# EAGLE schematic board (EAGLE 7.7.0)
8088 board with RAM expansion

## Sheet 1 of 10: CBM mainboard connectors
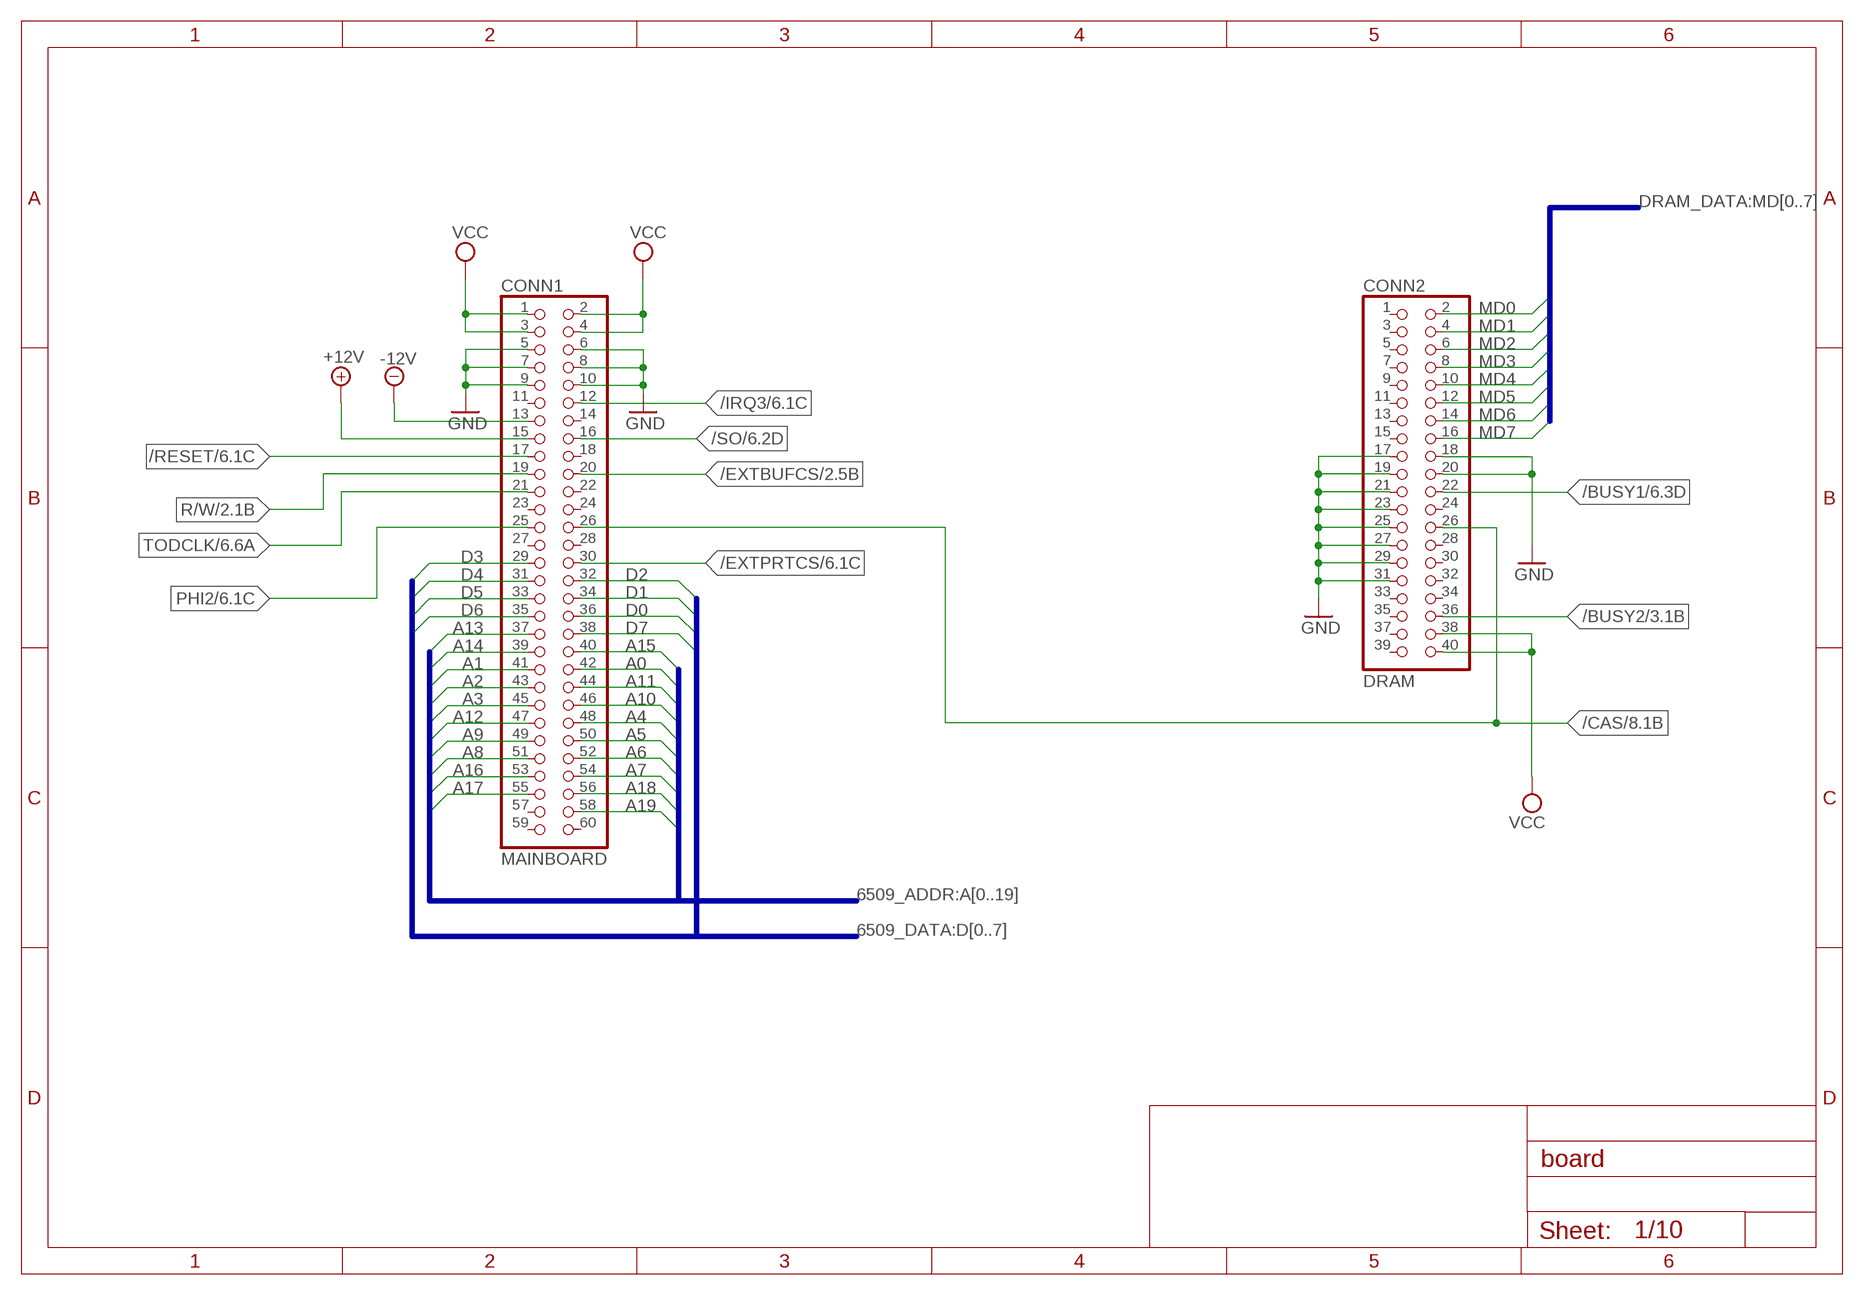
[diagram p0: schematic, sheet 1]

### Parts
CONN1  MAINBOARD  PINHD-2X30  [2X30]
CONN2  DRAM  PINHD-2X20  [2X20]

### Nets
+12V [power]: CONN1.15 ; also sheet 9
-12V [power]: CONN1.13 ; also sheet 9
/BUSY1: CONN2.22 ; also sheet 6,8
/BUSY2: CONN2.36 ; also sheet 3,8,10
/CAS: CONN1.26 CONN2.26 ; also sheet 8
/EXTBUFCS: CONN1.20 ; also sheet 2
/EXTPRTCS: CONN1.30 ; also sheet 6
/IRQ3: CONN1.12 ; also sheet 6
/RESET: CONN1.17 ; also sheet 6,8
/SO: CONN1.16 ; also sheet 6
A0: CONN1.42 ; also sheet 2,3,6
A1: CONN1.41 ; also sheet 2,3,6
A2: CONN1.43 ; also sheet 2,3,6
A3: CONN1.45 ; also sheet 2,3,6
A4: CONN1.48 ; also sheet 2,3
A5: CONN1.50 ; also sheet 2,3
A6: CONN1.52 ; also sheet 2,3
A7: CONN1.54 ; also sheet 2,3
A8: CONN1.51 ; also sheet 2,3
A9: CONN1.49 ; also sheet 2,3
A10: CONN1.46 ; also sheet 2,3
A11: CONN1.44 ; also sheet 2,3
A12: CONN1.47 ; also sheet 2,3,8
A13: CONN1.37 ; also sheet 3,8
A14: CONN1.39 ; also sheet 3,8
A15: CONN1.40 ; also sheet 3,8
A16: CONN1.53 ; also sheet 4,8
A17: CONN1.55 ; also sheet 4,8
A18: CONN1.56 ; also sheet 4,8
A19: CONN1.58 ; also sheet 8
D0: CONN1.36 ; also sheet 2,6
D1: CONN1.34 ; also sheet 2,6
D2: CONN1.32 ; also sheet 2,6
D3: CONN1.29 ; also sheet 2,6
D4: CONN1.31 ; also sheet 2,6
D5: CONN1.33 ; also sheet 2,6
D6: CONN1.35 ; also sheet 2,6
D7: CONN1.38 ; also sheet 2,6
GND [power]: CONN1.5 CONN1.6 CONN1.7 CONN1.8 CONN1.9 CONN1.10 CONN2.17 CONN2.18 CONN2.19 CONN2.20 CONN2.21 CONN2.23 CONN2.25 CONN2.27 CONN2.29 CONN2.31 ; also sheet 2,3,4,5,6,7,8,9,10
MD0: CONN2.2 ; also sheet 4
MD1: CONN2.4 ; also sheet 4
MD2: CONN2.6 ; also sheet 4
MD3: CONN2.8 ; also sheet 4
MD4: CONN2.10 ; also sheet 4
MD5: CONN2.12 ; also sheet 4
MD6: CONN2.14 ; also sheet 4
MD7: CONN2.16 ; also sheet 4
PHI2: CONN1.25 ; also sheet 6
R/W: CONN1.19 ; also sheet 2,6,8
TODCLK: CONN1.21 ; also sheet 6
VCC [power]: CONN1.1 CONN1.2 CONN1.3 CONN1.4 CONN2.38 CONN2.40 ; also sheet 2,3,4,5,6,7,8,9,10
Unconnected: CONN1.11 CONN1.14 CONN1.18 CONN1.22 CONN1.23 CONN1.24 CONN1.27 CONN1.28 CONN1.57 CONN1.59 CONN1.60 CONN2.1 CONN2.3 CONN2.5 CONN2.7 CONN2.9 CONN2.11 CONN2.13 CONN2.15 CONN2.24 CONN2.28 CONN2.30 CONN2.32 CONN2.33 CONN2.34 CONN2.35 CONN2.37 CONN2.39

### Buses
6509_ADDR:A[0..19]
6509_DATA:D[0..7]
DRAM_DATA:MD[0..7]

## Sheet 2 of 10: 6509 expansion EPROMs
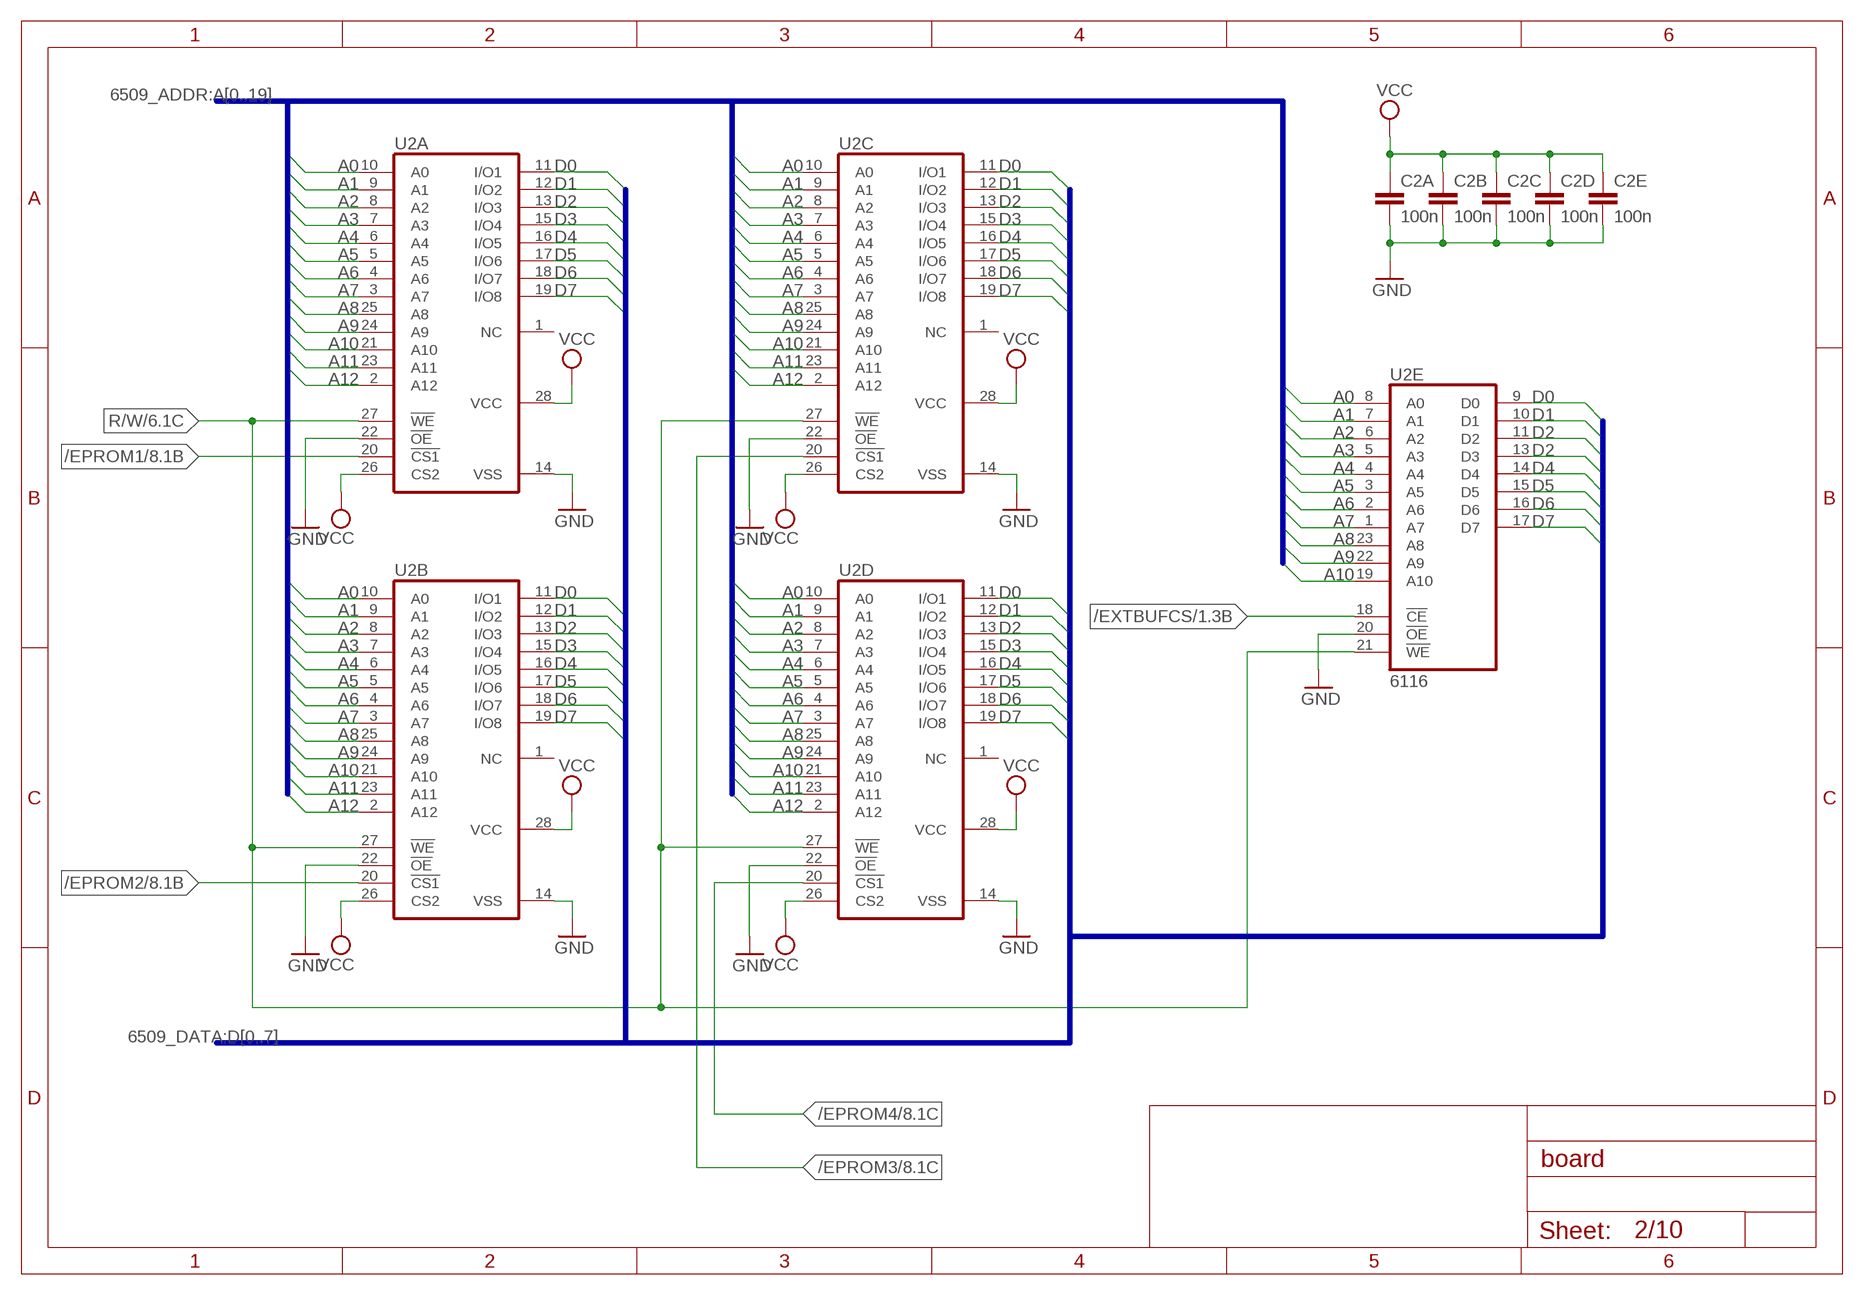
[diagram p1: schematic, sheet 2]

### Parts
C2A  100n  C-EU050-025X075  [C050-025X075]
C2B  100n  C-EU050-025X075  [C050-025X075]
C2C  100n  C-EU050-025X075  [C050-025X075]
C2D  100n  C-EU050-025X075  [C050-025X075]
C2E  100n  C-EU050-025X075  [C050-025X075]
U2A  6264A  [DIL28-6]
U2B  6264A  [DIL28-6]
U2C  6264A  [DIL28-6]
U2D  6264A  [DIL28-6]
U2E  6116  [DIL24]

### Nets
/EPROM1: U2A.20(!CS1) ; also sheet 8
/EPROM2: U2B.20(!CS1) ; also sheet 8
/EPROM3: U2C.20(!CS1) ; also sheet 8
/EPROM4: U2D.20(!CS1) ; also sheet 8
/EXTBUFCS: U2E.18(!CE) ; also sheet 1
A0: U2A.10(A0) U2B.10(A0) U2C.10(A0) U2D.10(A0) U2E.8(A0) ; also sheet 1,3,6
A1: U2A.9(A1) U2B.9(A1) U2C.9(A1) U2D.9(A1) U2E.7(A1) ; also sheet 1,3,6
A2: U2A.8(A2) U2B.8(A2) U2C.8(A2) U2D.8(A2) U2E.6(A2) ; also sheet 1,3,6
A3: U2A.7(A3) U2B.7(A3) U2C.7(A3) U2D.7(A3) U2E.5(A3) ; also sheet 1,3,6
A4: U2A.6(A4) U2B.6(A4) U2C.6(A4) U2D.6(A4) U2E.4(A4) ; also sheet 1,3
A5: U2A.5(A5) U2B.5(A5) U2C.5(A5) U2D.5(A5) U2E.3(A5) ; also sheet 1,3
A6: U2A.4(A6) U2B.4(A6) U2C.4(A6) U2D.4(A6) U2E.2(A6) ; also sheet 1,3
A7: U2A.3(A7) U2B.3(A7) U2C.3(A7) U2D.3(A7) U2E.1(A7) ; also sheet 1,3
A8: U2A.25(A8) U2B.25(A8) U2C.25(A8) U2D.25(A8) U2E.23(A8) ; also sheet 1,3
A9: U2A.24(A9) U2B.24(A9) U2C.24(A9) U2D.24(A9) U2E.22(A9) ; also sheet 1,3
A10: U2A.21(A10) U2B.21(A10) U2C.21(A10) U2D.21(A10) U2E.19(A10) ; also sheet 1,3
A11: U2A.23(A11) U2B.23(A11) U2C.23(A11) U2D.23(A11) ; also sheet 1,3
A12: U2A.2(A12) U2B.2(A12) U2C.2(A12) U2D.2(A12) ; also sheet 1,3,8
D0: U2A.11(I/O1) U2B.11(I/O1) U2C.11(I/O1) U2D.11(I/O1) U2E.9(D0) ; also sheet 1,6
D1: U2A.12(I/O2) U2B.12(I/O2) U2C.12(I/O2) U2D.12(I/O2) U2E.10(D1) ; also sheet 1,6
D2: U2A.13(I/O3) U2B.13(I/O3) U2C.13(I/O3) U2D.13(I/O3) U2E.11(D2) ; also sheet 1,6
D3: U2A.15(I/O4) U2B.15(I/O4) U2C.15(I/O4) U2D.15(I/O4) U2E.13(D3) ; also sheet 1,6
D4: U2A.16(I/O5) U2B.16(I/O5) U2C.16(I/O5) U2D.16(I/O5) U2E.14(D4) ; also sheet 1,6
D5: U2A.17(I/O6) U2B.17(I/O6) U2C.17(I/O6) U2D.17(I/O6) U2E.15(D5) ; also sheet 1,6
D6: U2A.18(I/O7) U2B.18(I/O7) U2C.18(I/O7) U2D.18(I/O7) U2E.16(D6) ; also sheet 1,6
D7: U2A.19(I/O8) U2B.19(I/O8) U2C.19(I/O8) U2D.19(I/O8) U2E.17(D7) ; also sheet 1,6
GND [power]: C2A.2 C2B.2 C2C.2 C2D.2 C2E.2 U2A.14(VSS) U2A.22(!OE) U2B.14(VSS) U2B.22(!OE) U2C.14(VSS) U2C.22(!OE) U2D.14(VSS) U2D.22(!OE) U2E.20(!OE) ; also sheet 1,3,4,5,6,7,8,9,10
R/W: U2A.27(!WE) U2B.27(!WE) U2C.27(!WE) U2D.27(!WE) U2E.21(!WE) ; also sheet 1,6,8
VCC [power]: C2A.1 C2B.1 C2C.1 C2D.1 C2E.1 U2A.26(CS2) U2A.28(VCC) U2B.26(CS2) U2B.28(VCC) U2C.26(CS2) U2C.28(VCC) U2D.26(CS2) U2D.28(VCC) ; also sheet 1,3,4,5,6,7,8,9,10
Unconnected: U2A.1(NC) U2B.1(NC) U2C.1(NC) U2D.1(NC)

### Buses
6509_ADDR:A[0..19]
6509_DATA:D[0..7]

## Sheet 3 of 10: RAM address multiplexers
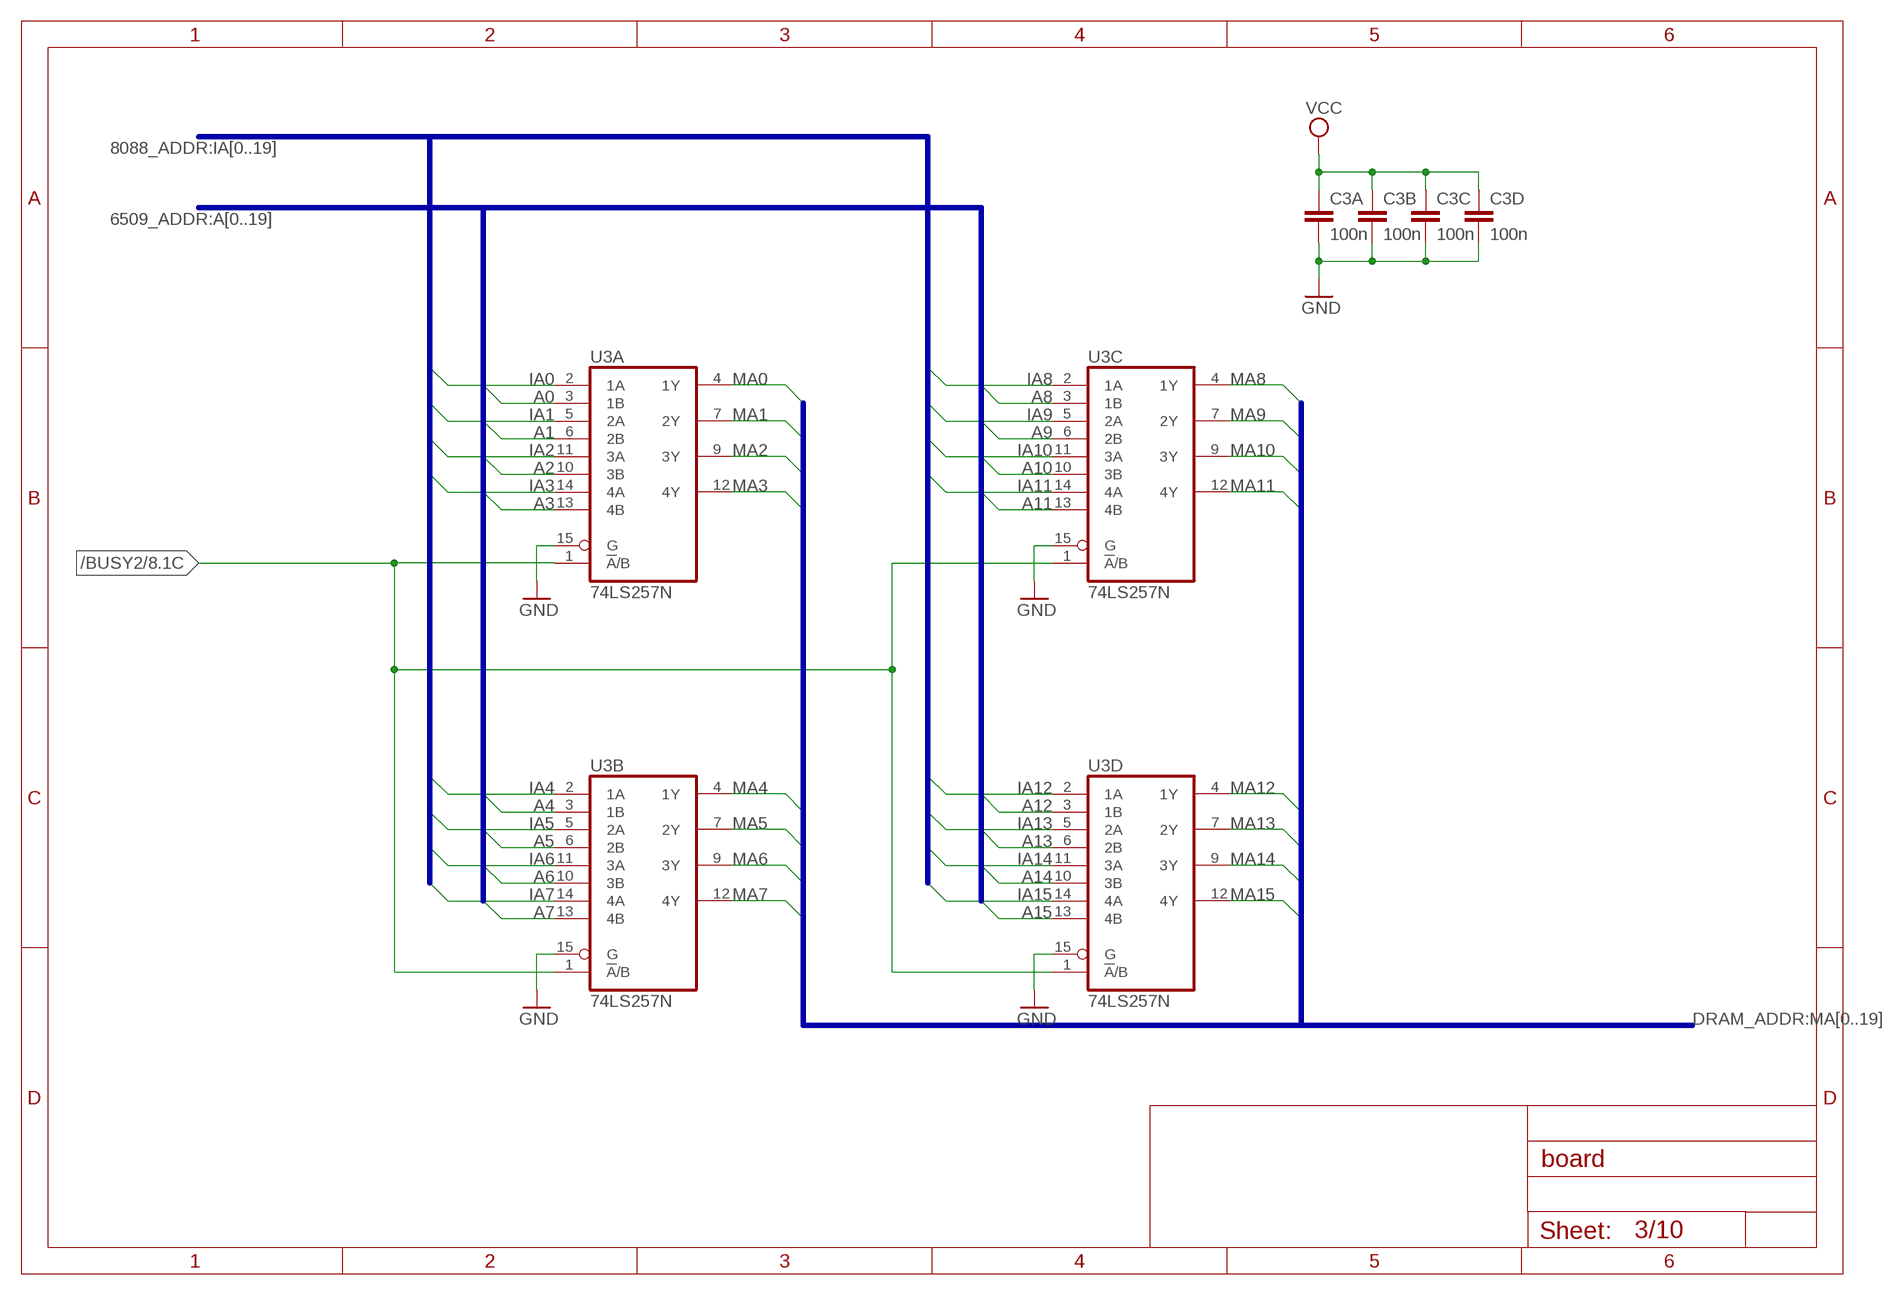
[diagram p2: schematic, sheet 3]

### Parts
C3A  100n  C-EU050-025X075  [C050-025X075]
C3B  100n  C-EU050-025X075  [C050-025X075]
C3C  100n  C-EU050-025X075  [C050-025X075]
C3D  100n  C-EU050-025X075  [C050-025X075]
U3A  74LS257N  [DIL16]
U3B  74LS257N  [DIL16]
U3C  74LS257N  [DIL16]
U3D  74LS257N  [DIL16]

### Nets
/BUSY2: U3A.1(!A!/B) U3B.1(!A!/B) U3C.1(!A!/B) U3D.1(!A!/B) ; also sheet 1,8,10
A0: U3A.3(1B) ; also sheet 1,2,6
A1: U3A.6(2B) ; also sheet 1,2,6
A2: U3A.10(3B) ; also sheet 1,2,6
A3: U3A.13(4B) ; also sheet 1,2,6
A4: U3B.3(1B) ; also sheet 1,2
A5: U3B.6(2B) ; also sheet 1,2
A6: U3B.10(3B) ; also sheet 1,2
A7: U3B.13(4B) ; also sheet 1,2
A8: U3C.3(1B) ; also sheet 1,2
A9: U3C.6(2B) ; also sheet 1,2
A10: U3C.10(3B) ; also sheet 1,2
A11: U3C.13(4B) ; also sheet 1,2
A12: U3D.3(1B) ; also sheet 1,2,8
A13: U3D.6(2B) ; also sheet 1,8
A14: U3D.10(3B) ; also sheet 1,8
A15: U3D.13(4B) ; also sheet 1,8
GND [power]: C3A.2 C3B.2 C3C.2 C3D.2 U3A.15(G) U3B.15(G) U3C.15(G) U3D.15(G) ; also sheet 1,2,4,5,6,7,8,9,10
IA0: U3A.2(1A) ; also sheet 6,7,9
IA1: U3A.5(2A) ; also sheet 6,7,9
IA2: U3A.11(3A) ; also sheet 7,9
IA3: U3A.14(4A) ; also sheet 7,9
IA4: U3B.2(1A) ; also sheet 7,9
IA5: U3B.5(2A) ; also sheet 7,9
IA6: U3B.11(3A) ; also sheet 7,9
IA7: U3B.14(4A) ; also sheet 7,9
IA8: U3C.2(1A) ; also sheet 7,8,9
IA9: U3C.5(2A) ; also sheet 7,8,9
IA10: U3C.11(3A) ; also sheet 7,8,9
IA11: U3C.14(4A) ; also sheet 7,8,9
IA12: U3D.2(1A) ; also sheet 7,9
IA13: U3D.5(2A) ; also sheet 7,9
IA14: U3D.11(3A) ; also sheet 7,9
IA15: U3D.14(4A) ; also sheet 7,9
MA0: U3A.4(1Y) ; also sheet 4
MA1: U3A.7(2Y) ; also sheet 4
MA2: U3A.9(3Y) ; also sheet 4
MA3: U3A.12(4Y) ; also sheet 4
MA4: U3B.4(1Y) ; also sheet 4
MA5: U3B.7(2Y) ; also sheet 4
MA6: U3B.9(3Y) ; also sheet 4
MA7: U3B.12(4Y) ; also sheet 4
MA8: U3C.4(1Y) ; also sheet 4
MA9: U3C.7(2Y) ; also sheet 4
MA10: U3C.9(3Y) ; also sheet 4
MA11: U3C.12(4Y) ; also sheet 4
MA12: U3D.4(1Y) ; also sheet 4
MA13: U3D.7(2Y) ; also sheet 4
MA14: U3D.9(3Y) ; also sheet 4
MA15: U3D.12(4Y) ; also sheet 4
VCC [power]: C3A.1 C3B.1 C3C.1 C3D.1 ; also sheet 1,2,4,5,6,7,8,9,10

### Buses
6509_ADDR:A[0..19]
8088_ADDR:IA[0..19]
DRAM_ADDR:MA[0..19]

## Sheet 4 of 10: Expansion RAM
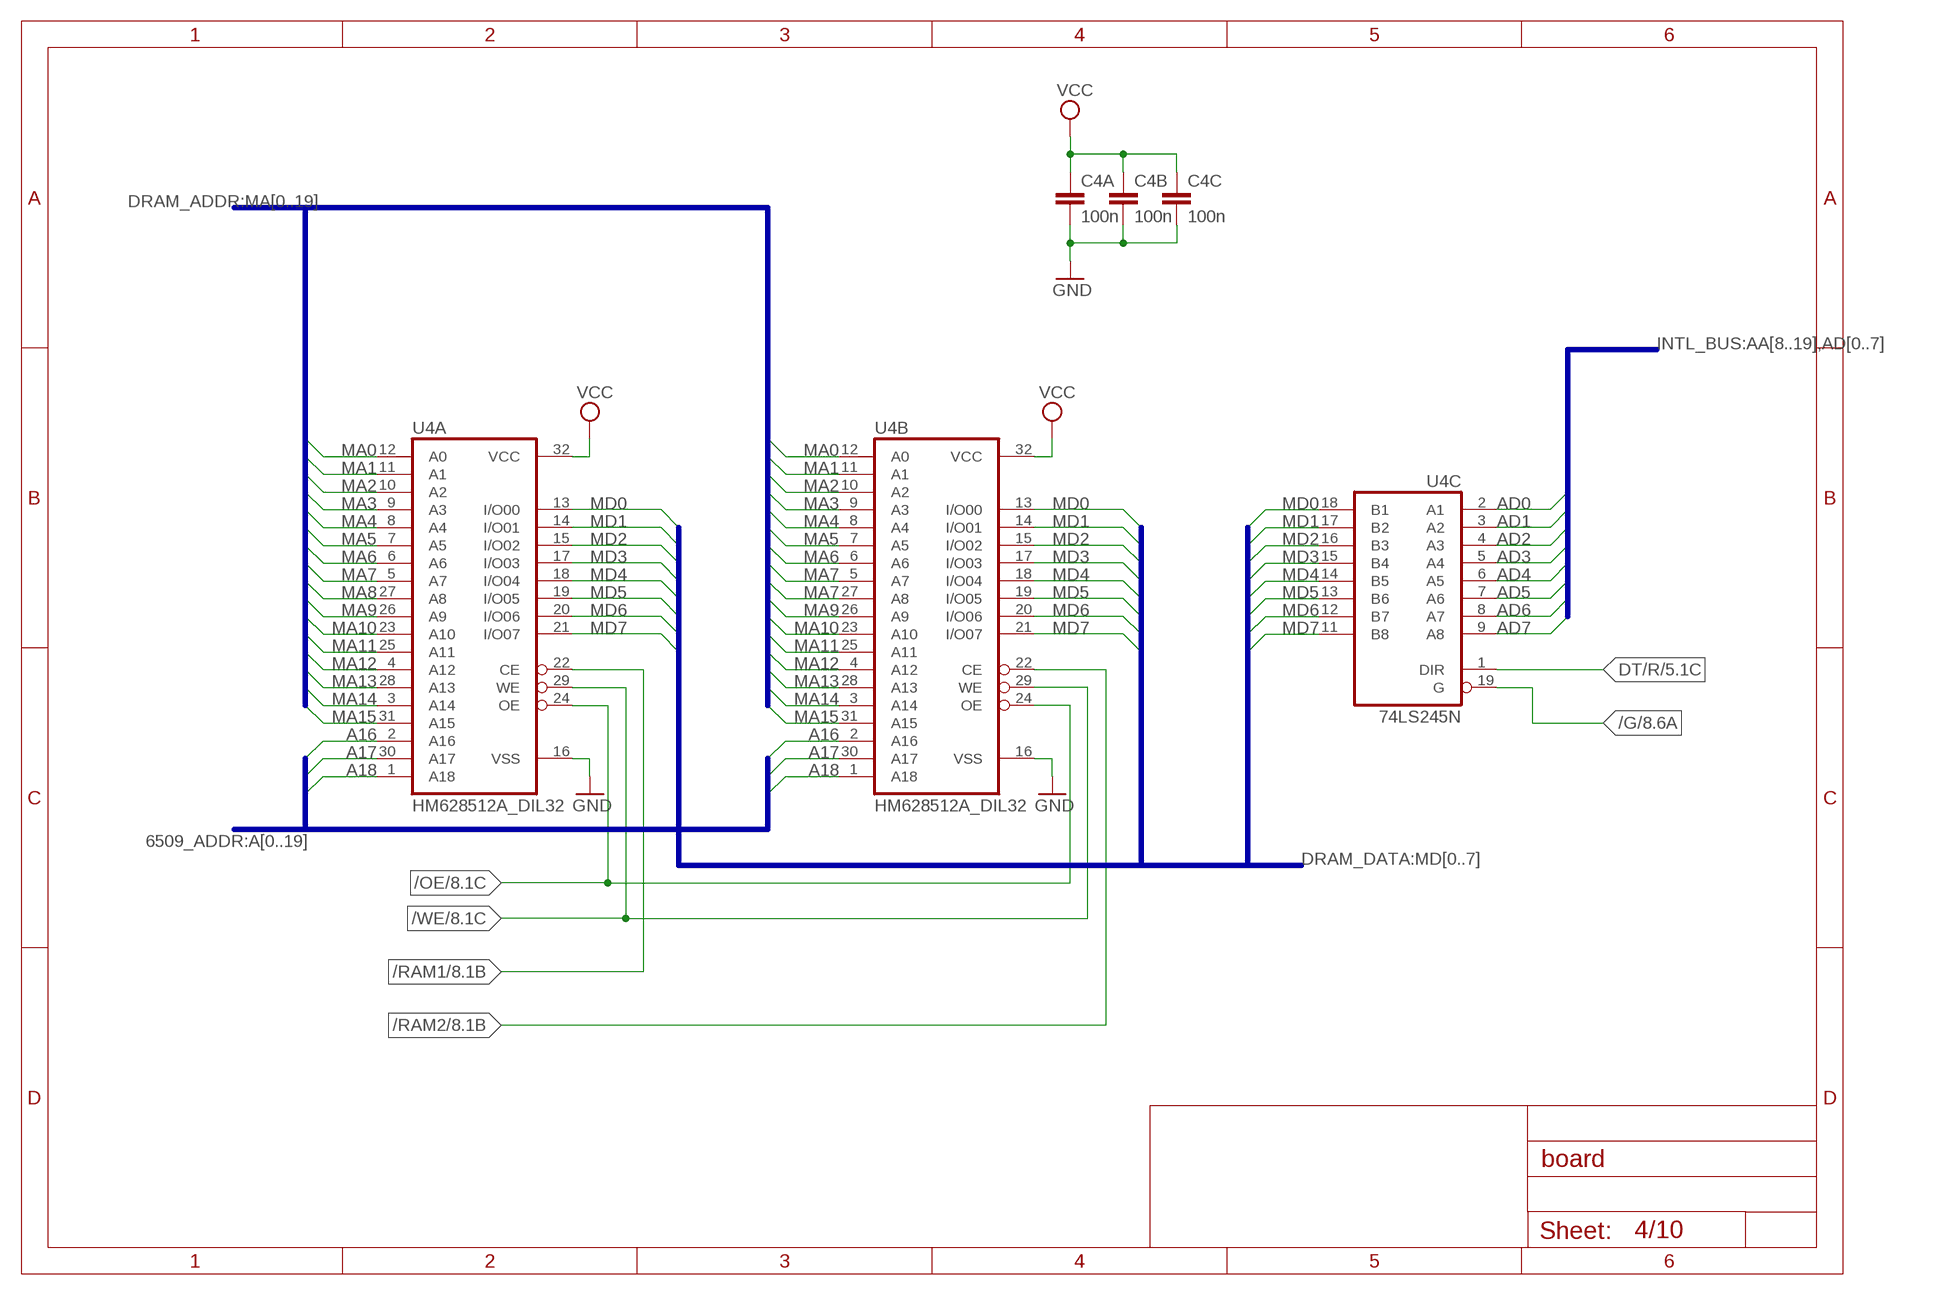
[diagram p3: schematic, sheet 4]

### Parts
C4A  100n  C-EU050-025X075  [C050-025X075]
C4B  100n  C-EU050-025X075  [C050-025X075]
C4C  100n  C-EU050-025X075  [C050-025X075]
U4A  HM628512A_DIL32  [DIL32]
U4B  HM628512A_DIL32  [DIL32]
U4C  74LS245N  [DIL20]

### Nets
/G: U4C.19(G) ; also sheet 8
/OE: U4A.24(OE) U4B.24(OE) ; also sheet 8
/RAM1: U4A.22(CE) ; also sheet 8
/RAM2: U4B.22(CE) ; also sheet 8
/WE: U4A.29(WE) U4B.29(WE) ; also sheet 8
A16: U4A.2(A16) U4B.2(A16) ; also sheet 1,8
A17: U4A.30(A17) U4B.30(A17) ; also sheet 1,8
A18: U4A.1(A18) U4B.1(A18) ; also sheet 1,8
AD0: U4C.2(A1) ; also sheet 5,6,7,8,9
AD1: U4C.3(A2) ; also sheet 5,6,7,8,9
AD2: U4C.4(A3) ; also sheet 5,6,7,8,9
AD3: U4C.5(A4) ; also sheet 5,6,7,8,9
AD4: U4C.6(A5) ; also sheet 5,6,7,8,9
AD5: U4C.7(A6) ; also sheet 5,6,7,8,9
AD6: U4C.8(A7) ; also sheet 5,6,7,8,9
AD7: U4C.9(A8) ; also sheet 5,6,7,8,9
DT/R: U4C.1(DIR) ; also sheet 5
GND [power]: C4A.2 C4B.2 C4C.2 U4A.16(VSS) U4B.16(VSS) ; also sheet 1,2,3,5,6,7,8,9,10
MA0: U4A.12(A0) U4B.12(A0) ; also sheet 3
MA1: U4A.11(A1) U4B.11(A1) ; also sheet 3
MA2: U4A.10(A2) U4B.10(A2) ; also sheet 3
MA3: U4A.9(A3) U4B.9(A3) ; also sheet 3
MA4: U4A.8(A4) U4B.8(A4) ; also sheet 3
MA5: U4A.7(A5) U4B.7(A5) ; also sheet 3
MA6: U4A.6(A6) U4B.6(A6) ; also sheet 3
MA7: U4A.5(A7) U4B.5(A7) ; also sheet 3
MA8: U4A.27(A8) U4B.27(A8) ; also sheet 3
MA9: U4A.26(A9) U4B.26(A9) ; also sheet 3
MA10: U4A.23(A10) U4B.23(A10) ; also sheet 3
MA11: U4A.25(A11) U4B.25(A11) ; also sheet 3
MA12: U4A.4(A12) U4B.4(A12) ; also sheet 3
MA13: U4A.28(A13) U4B.28(A13) ; also sheet 3
MA14: U4A.3(A14) U4B.3(A14) ; also sheet 3
MA15: U4A.31(A15) U4B.31(A15) ; also sheet 3
MD0: U4A.13(I/O00) U4B.13(I/O00) U4C.18(B1) ; also sheet 1
MD1: U4A.14(I/O01) U4B.14(I/O01) U4C.17(B2) ; also sheet 1
MD2: U4A.15(I/O02) U4B.15(I/O02) U4C.16(B3) ; also sheet 1
MD3: U4A.17(I/O03) U4B.17(I/O03) U4C.15(B4) ; also sheet 1
MD4: U4A.18(I/O04) U4B.18(I/O04) U4C.14(B5) ; also sheet 1
MD5: U4A.19(I/O05) U4B.19(I/O05) U4C.13(B6) ; also sheet 1
MD6: U4A.20(I/O06) U4B.20(I/O06) U4C.12(B7) ; also sheet 1
MD7: U4A.21(I/O07) U4B.21(I/O07) U4C.11(B8) ; also sheet 1
VCC [power]: C4A.1 C4B.1 C4C.1 U4A.32(VCC) U4B.32(VCC) ; also sheet 1,2,3,5,6,7,8,9,10

### Buses
DRAM_ADDR:MA[0..19]
DRAM_DATA:MD[0..7]
INTL_BUS:AA[8..19],AD[0..7]
6509_ADDR:A[0..19]

## Sheet 5 of 10: 8088 processor
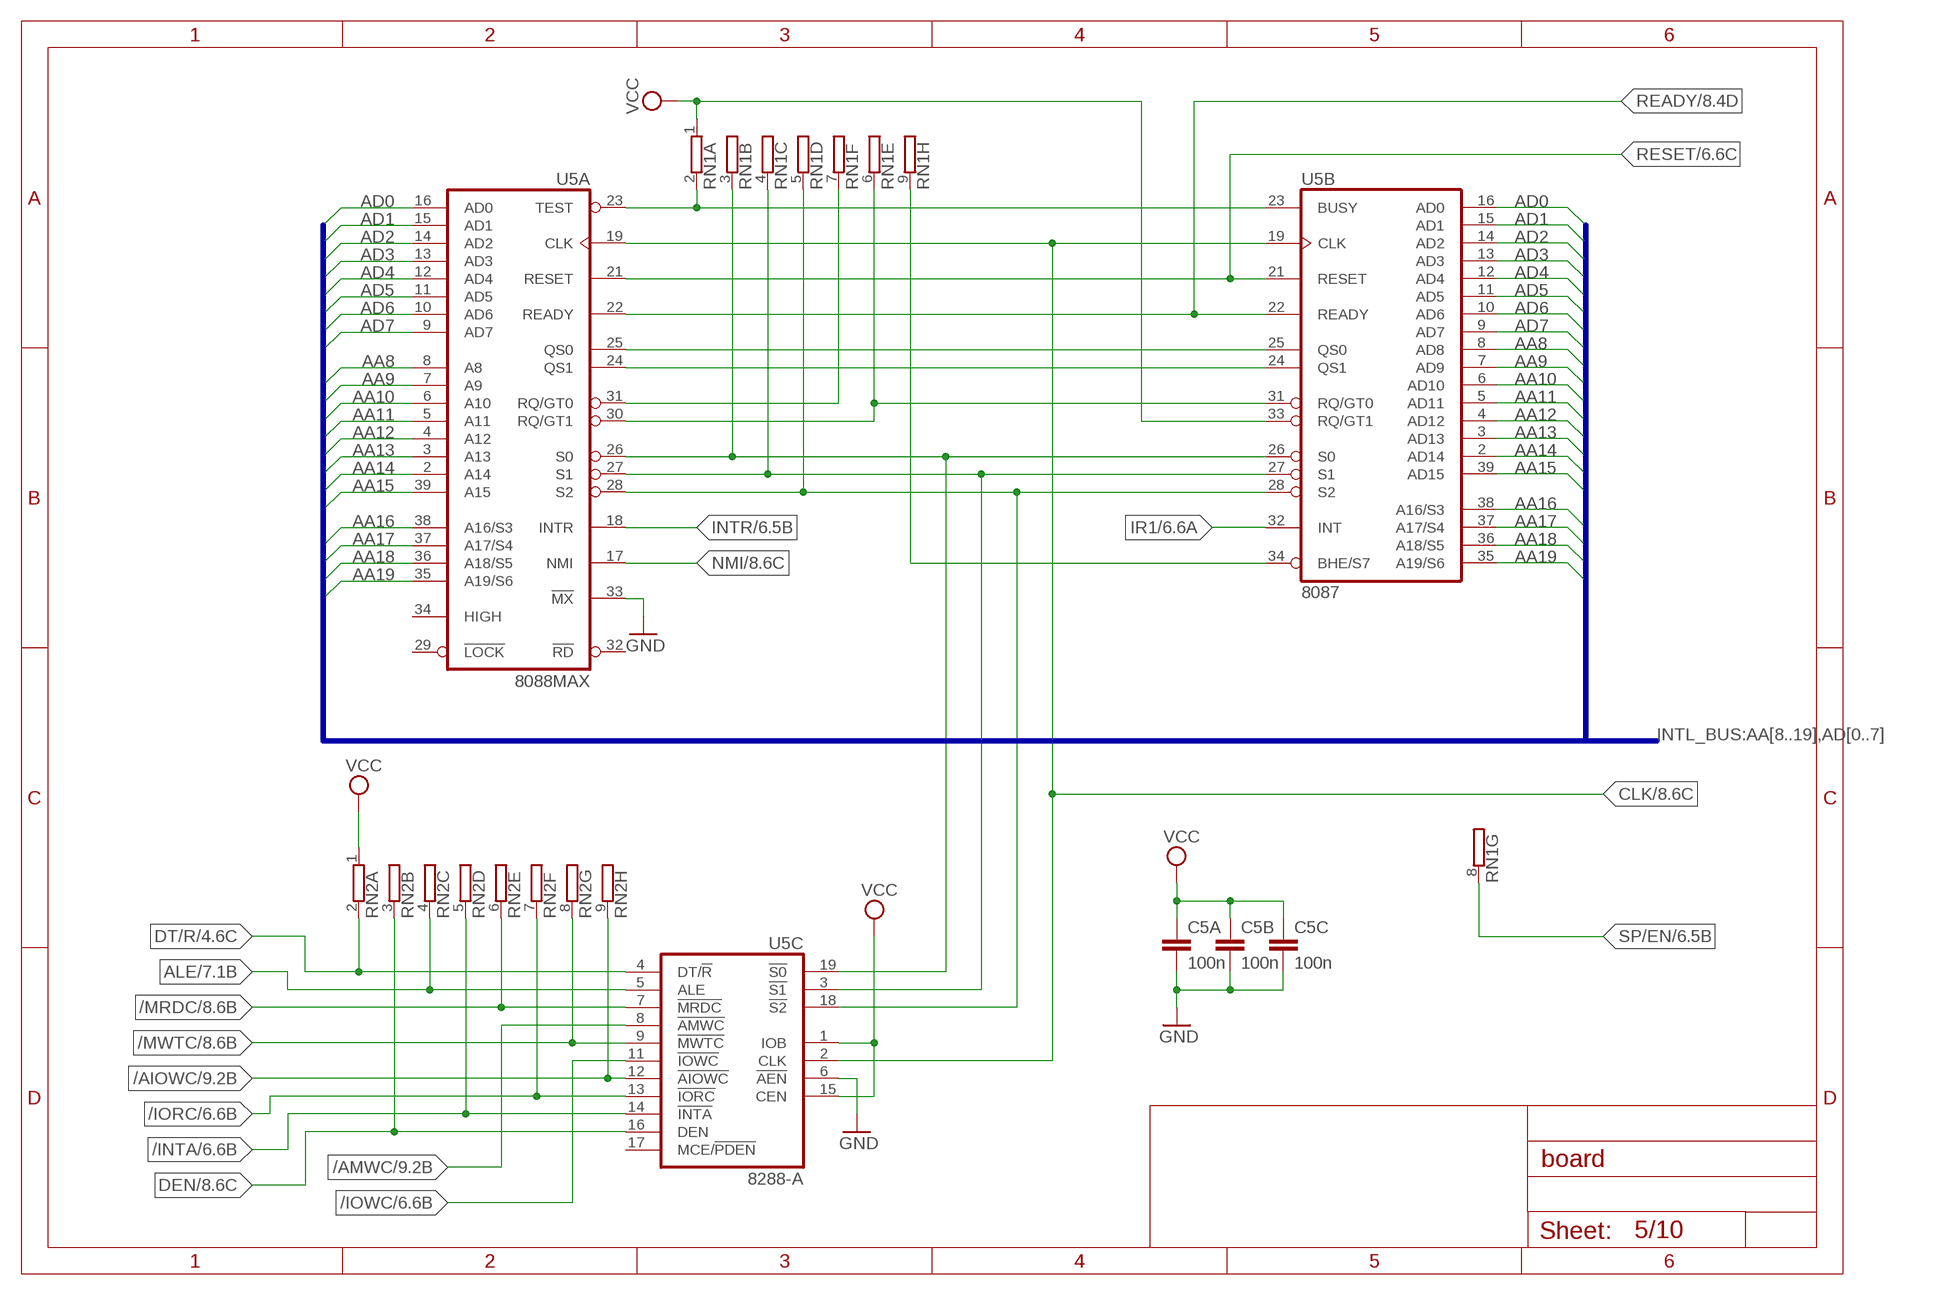
[diagram p4: schematic, sheet 5]

### Parts
C5A  100n  C-EU050-025X075  [C050-025X075]
C5B  100n  C-EU050-025X075  [C050-025X075]
C5C  100n  C-EU050-025X075  [C050-025X075]
RN1  GE08R  [SIL9]
RN2  GE08R  [SIL9]
U5A  8088MAX  [DIL40]
U5B  8087  [DIL40]
U5C  8288-A  [DIL20]

### Nets
/AIOWC: RN2.9 U5C.12(!AIOWC) ; also sheet 9
/AMWC: U5C.8(!AMWC) ; also sheet 9
/INTA: RN2.5 U5C.14(!INTA) ; also sheet 6
/IORC: RN2.7 U5C.13(!IORC) ; also sheet 6,8,9
/IOWC: U5C.11(!IOWC) ; also sheet 6,8,9
/MRDC: RN2.6 U5C.7(!MRDC) ; also sheet 8,9
/MWTC: RN2.8 U5C.9(!MWTC) ; also sheet 8,9
/TEST: RN1.2 U5A.23(TEST) U5B.23(BUSY)
AA8: U5A.8(A8) U5B.8(AD8) ; also sheet 7
AA9: U5A.7(A9) U5B.7(AD9) ; also sheet 7
AA10: U5A.6(A10) U5B.6(AD10) ; also sheet 7
AA11: U5A.5(A11) U5B.5(AD11) ; also sheet 7
AA12: U5A.4(A12) U5B.4(AD12) ; also sheet 7
AA13: U5A.3(A13) U5B.3(AD13) ; also sheet 7
AA14: U5A.2(A14) U5B.2(AD14) ; also sheet 7
AA15: U5A.39(A15) U5B.39(AD15) ; also sheet 7
AA16: U5A.38(A16/S3) U5B.38(A16/S3) ; also sheet 7
AA17: U5A.37(A17/S4) U5B.37(A17/S4) ; also sheet 7
AA18: U5A.36(A18/S5) U5B.36(A18/S5) ; also sheet 7
AA19: U5A.35(A19/S6) U5B.35(A19/S6) ; also sheet 7
AD0: U5A.16(AD0) U5B.16(AD0) ; also sheet 4,6,7,8,9
AD1: U5A.15(AD1) U5B.15(AD1) ; also sheet 4,6,7,8,9
AD2: U5A.14(AD2) U5B.14(AD2) ; also sheet 4,6,7,8,9
AD3: U5A.13(AD3) U5B.13(AD3) ; also sheet 4,6,7,8,9
AD4: U5A.12(AD4) U5B.12(AD4) ; also sheet 4,6,7,8,9
AD5: U5A.11(AD5) U5B.11(AD5) ; also sheet 4,6,7,8,9
AD6: U5A.10(AD6) U5B.10(AD6) ; also sheet 4,6,7,8,9
AD7: U5A.9(AD7) U5B.9(AD7) ; also sheet 4,6,7,8,9
ALE: RN2.4 U5C.5(ALE) ; also sheet 7,8,9
BHE/S7: RN1.9 U5B.34(BHE/S7)
CLK: U5A.19(CLK) U5B.19(CLK) U5C.2(CLK) ; also sheet 8,9
DEN: RN2.3 U5C.16(DEN) ; also sheet 8
DT/R: RN2.2 U5C.4(DT/!R) ; also sheet 4
GND [power]: C5A.2 C5B.2 C5C.2 U5A.33(!MX) U5C.6(!AEN) ; also sheet 1,2,3,4,6,7,8,9,10
INTR: U5A.18(INTR) ; also sheet 6
IR1: U5B.32(INT) ; also sheet 6
NMI: U5A.17(NMI) ; also sheet 8
QS0: U5A.25(QS0) U5B.25(QS0)
QS1: U5A.24(QS1) U5B.24(QS1)
READY: U5A.22(READY) U5B.22(READY) ; also sheet 8
RESET: U5A.21(RESET) U5B.21(RESET) ; also sheet 6,8,9
RQ: RN1.7 U5A.31(RQ/GT0)
RQ/GT0: RN1.6 U5A.30(RQ/GT1) U5B.31(RQ/GT0)
S0: RN1.3 U5A.26(S0) U5B.26(S0) U5C.19(!S0)
S1: RN1.4 U5A.27(S1) U5B.27(S1) U5C.3(!S1)
S2: RN1.5 U5A.28(S2) U5B.28(S2) U5C.18(!S2)
SP/EN: RN1.8 ; also sheet 6,8
VCC [power]: C5A.1 C5B.1 C5C.1 RN1.1 RN2.1 U5B.33(RQ/GT1) U5C.1(IOB) U5C.15(CEN) ; also sheet 1,2,3,4,6,7,8,9,10
Unconnected: U5A.29(!LOCK) U5A.32(!RD) U5A.34(HIGH) U5C.17(MCE/!PDEN)

### Buses
INTL_BUS:AA[8..19],AD[0..7]

## Sheet 6 of 10: IPC and interrupts
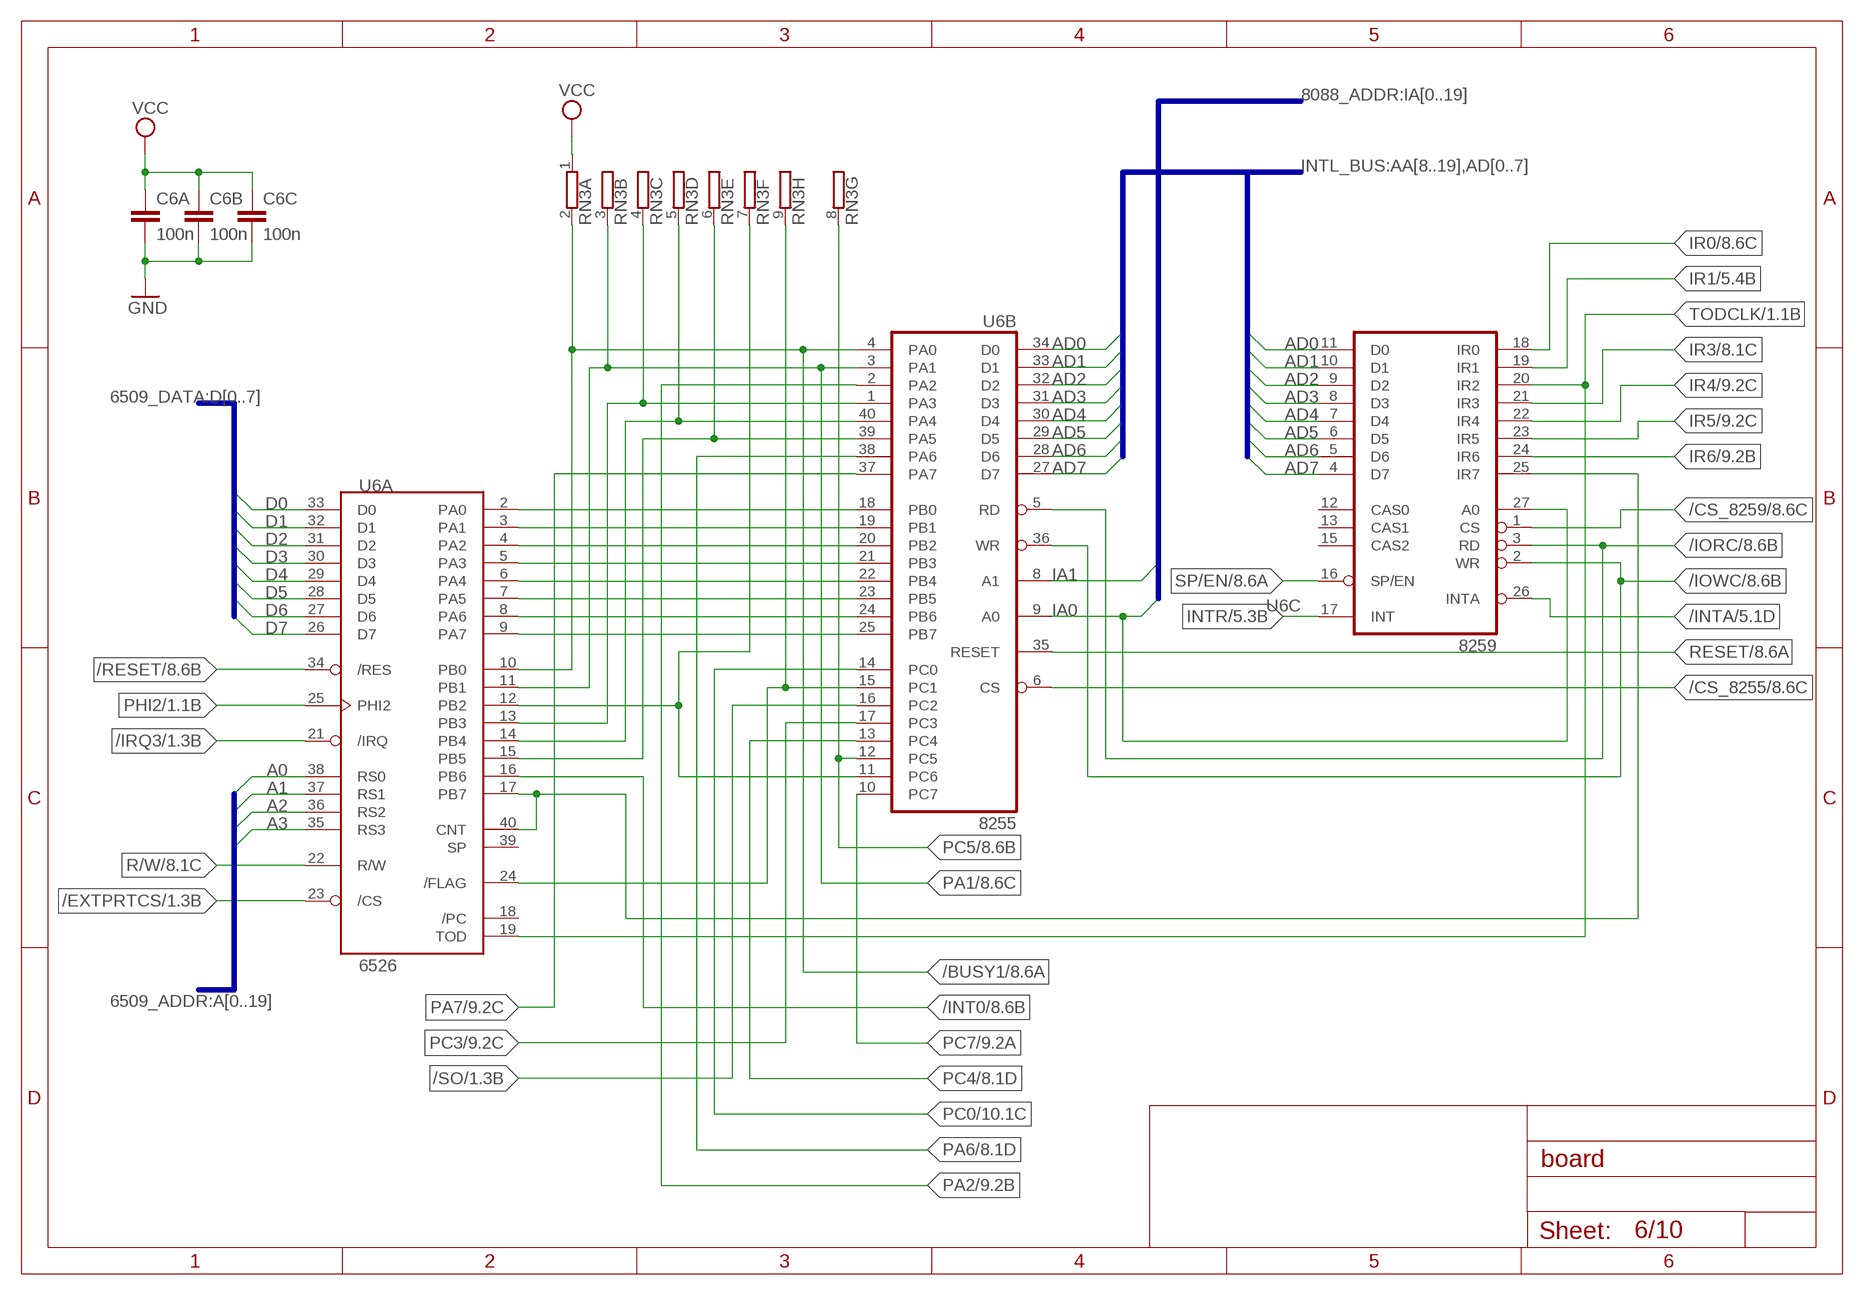
[diagram p5: schematic, sheet 6]

### Parts
C6A  100n  C-EU050-025X075  [C050-025X075]
C6B  100n  C-EU050-025X075  [C050-025X075]
C6C  100n  C-EU050-025X075  [C050-025X075]
RN3  GE08R  [SIL9]
U6A  6526  [DIP40]
U6B  8255  8255A  [DIL40]
U6C  8259  8259A  [DIL28-6]

### Nets
/BUSY1: RN3.2 U6A.10(PB0) U6B.4(PA0) ; also sheet 1,8
/CS_8255: U6B.6(CS) ; also sheet 8
/CS_8259: U6C.1(CS) ; also sheet 8
/EXTPRTCS: U6A.23(/CS) ; also sheet 1
/INT0: U6A.16(PB6) ; also sheet 8
/INTA: U6C.26(INTA) ; also sheet 5
/IORC: U6B.5(RD) U6C.3(RD) ; also sheet 5,8,9
/IOWC: U6B.36(WR) U6C.2(WR) ; also sheet 5,8,9
/IRQ3: U6A.21(/IRQ) ; also sheet 1
/RESET: U6A.34(/RES) ; also sheet 1,8
/SO: U6B.16(PC2) ; also sheet 1
A0: U6A.38(RS0) ; also sheet 1,2,3
A1: U6A.37(RS1) ; also sheet 1,2,3
A2: U6A.36(RS2) ; also sheet 1,2,3
A3: U6A.35(RS3) ; also sheet 1,2,3
AD0: U6B.34(D0) U6C.11(D0) ; also sheet 4,5,7,8,9
AD1: U6B.33(D1) U6C.10(D1) ; also sheet 4,5,7,8,9
AD2: U6B.32(D2) U6C.9(D2) ; also sheet 4,5,7,8,9
AD3: U6B.31(D3) U6C.8(D3) ; also sheet 4,5,7,8,9
AD4: U6B.30(D4) U6C.7(D4) ; also sheet 4,5,7,8,9
AD5: U6B.29(D5) U6C.6(D5) ; also sheet 4,5,7,8,9
AD6: U6B.28(D6) U6C.5(D6) ; also sheet 4,5,7,8,9
AD7: U6B.27(D7) U6C.4(D7) ; also sheet 4,5,7,8,9
D0: U6A.33(D0) ; also sheet 1,2
D1: U6A.32(D1) ; also sheet 1,2
D2: U6A.31(D2) ; also sheet 1,2
D3: U6A.30(D3) ; also sheet 1,2
D4: U6A.29(D4) ; also sheet 1,2
D5: U6A.28(D5) ; also sheet 1,2
D6: U6A.27(D6) ; also sheet 1,2
D7: U6A.26(D7) ; also sheet 1,2
GND [power]: C6A.2 C6B.2 C6C.2 ; also sheet 1,2,3,4,5,7,8,9,10
IA0: U6B.9(A0) U6C.27(A0) ; also sheet 3,7,9
IA1: U6B.8(A1) ; also sheet 3,7,9
INTR: U6C.17(INT) ; also sheet 5
IR0: U6C.18(IR0) ; also sheet 8
IR1: U6C.19(IR1) ; also sheet 5
IR3: U6C.21(IR3) ; also sheet 8,9
IR4: U6C.22(IR4) ; also sheet 9
IR5: U6C.23(IR5) ; also sheet 9
IR6: U6C.24(IR6) ; also sheet 9
IR7: U6A.17(PB7) U6A.40(CNT) U6C.25(IR7)
PA1: RN3.3 U6A.11(PB1) U6B.3(PA1) ; also sheet 8
PA2: U6B.2(PA2) ; also sheet 9
PA3: RN3.4 U6A.13(PB3) U6B.1(PA3)
PA4: RN3.5 U6A.14(PB4) U6B.40(PA4)
PA5: RN3.6 U6A.15(PB5) U6B.39(PA5)
PA6: U6B.38(PA6) ; also sheet 8,9
PA7: U6B.37(PA7) ; also sheet 9
PB0: U6A.2(PA0) U6B.18(PB0)
PB1: U6A.3(PA1) U6B.19(PB1)
PB2: U6A.4(PA2) U6B.20(PB2)
PB3: U6A.5(PA3) U6B.21(PB3)
PB4: U6A.6(PA4) U6B.22(PB4)
PB5: U6A.7(PA5) U6B.23(PB5)
PB6: U6A.8(PA6) U6B.24(PB6)
PB7: U6A.9(PA7) U6B.25(PB7)
PC0: U6B.14(PC0) ; also sheet 10
PC1: RN3.9 U6A.24(/FLAG) U6B.15(PC1)
PC3: U6B.17(PC3) ; also sheet 9
PC4: U6B.13(PC4) ; also sheet 8,9
PC5: RN3.8 U6B.12(PC5) ; also sheet 8
PC6: RN3.7 U6A.12(PB2) U6B.11(PC6)
PC7: U6B.10(PC7) ; also sheet 9,10
PHI2: U6A.25(PHI2) ; also sheet 1
R/W: U6A.22(R/W) ; also sheet 1,2,8
RESET: U6B.35(RESET) ; also sheet 5,8,9
SP/EN: U6C.16(SP/EN) ; also sheet 5,8
TODCLK: U6A.19(TOD) U6C.20(IR2) ; also sheet 1
VCC [power]: C6A.1 C6B.1 C6C.1 RN3.1 ; also sheet 1,2,3,4,5,7,8,9,10
Unconnected: U6A.18(/PC) U6A.39(SP) U6C.12(CAS0) U6C.13(CAS1) U6C.15(CAS2)

### Buses
6509_DATA:D[0..7]
INTL_BUS:AA[8..19],AD[0..7]
6509_ADDR:A[0..19]
8088_ADDR:IA[0..19]

## Sheet 7 of 10: 8088 address latches
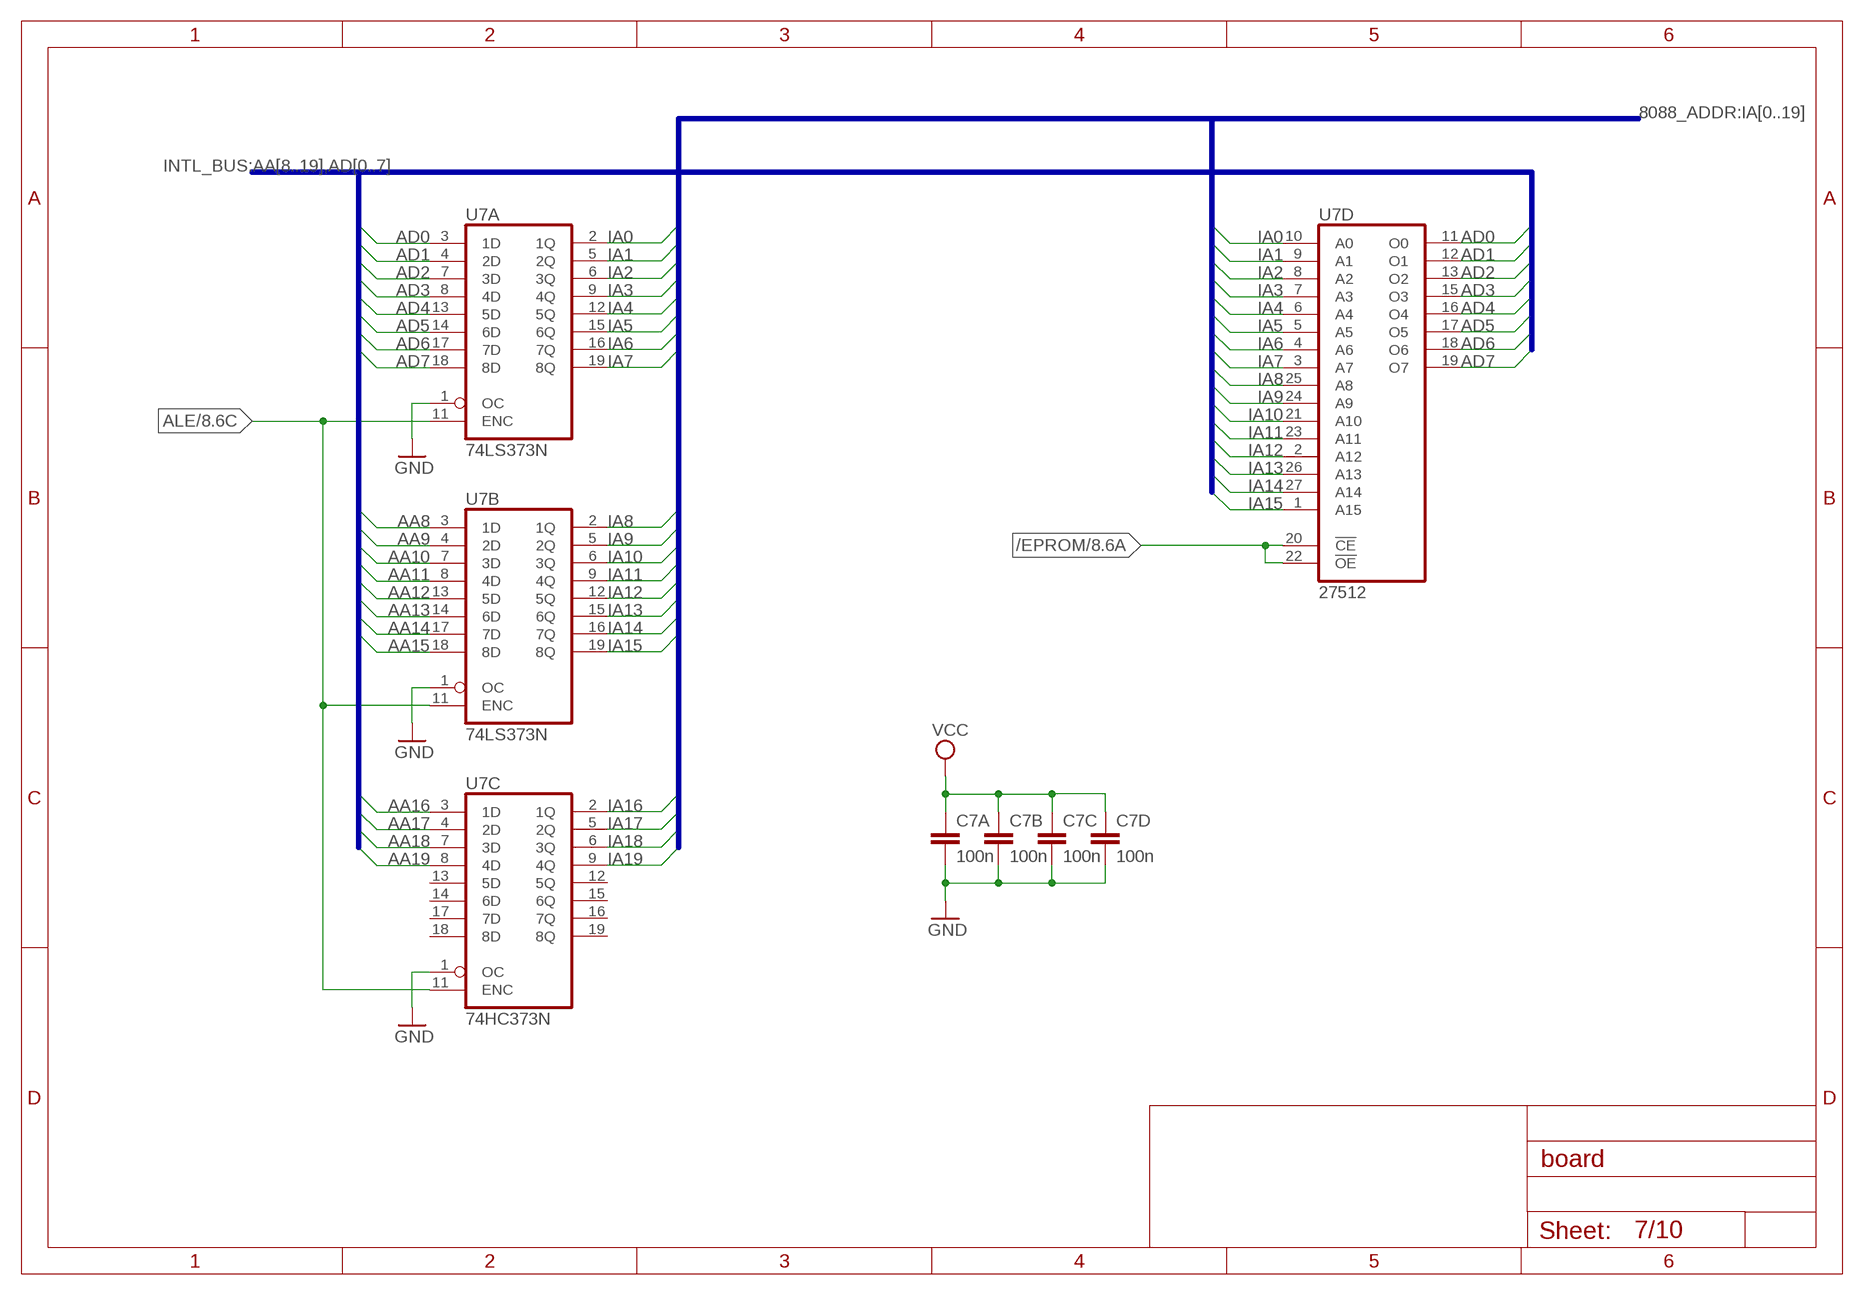
[diagram p6: schematic, sheet 7]

### Parts
C7A  100n  C-EU050-025X075  [C050-025X075]
C7B  100n  C-EU050-025X075  [C050-025X075]
C7C  100n  C-EU050-025X075  [C050-025X075]
C7D  100n  C-EU050-025X075  [C050-025X075]
U7A  74LS373N  [DIL20]
U7B  74LS373N  [DIL20]
U7C  74HC373N  [DIL20]
U7D  27512  [DIL28]

### Nets
/EPROM: U7D.20(!CE) U7D.22(!OE) ; also sheet 8
AA8: U7B.3(1D) ; also sheet 5
AA9: U7B.4(2D) ; also sheet 5
AA10: U7B.7(3D) ; also sheet 5
AA11: U7B.8(4D) ; also sheet 5
AA12: U7B.13(5D) ; also sheet 5
AA13: U7B.14(6D) ; also sheet 5
AA14: U7B.17(7D) ; also sheet 5
AA15: U7B.18(8D) ; also sheet 5
AA16: U7C.3(1D) ; also sheet 5
AA17: U7C.4(2D) ; also sheet 5
AA18: U7C.7(3D) ; also sheet 5
AA19: U7C.8(4D) ; also sheet 5
AD0: U7A.3(1D) U7D.11(O0) ; also sheet 4,5,6,8,9
AD1: U7A.4(2D) U7D.12(O1) ; also sheet 4,5,6,8,9
AD2: U7A.7(3D) U7D.13(O2) ; also sheet 4,5,6,8,9
AD3: U7A.8(4D) U7D.15(O3) ; also sheet 4,5,6,8,9
AD4: U7A.13(5D) U7D.16(O4) ; also sheet 4,5,6,8,9
AD5: U7A.14(6D) U7D.17(O5) ; also sheet 4,5,6,8,9
AD6: U7A.17(7D) U7D.18(O6) ; also sheet 4,5,6,8,9
AD7: U7A.18(8D) U7D.19(O7) ; also sheet 4,5,6,8,9
ALE: U7A.11(ENC) U7B.11(ENC) U7C.11(ENC) ; also sheet 5,8,9
GND [power]: C7A.2 C7B.2 C7C.2 C7D.2 U7A.1(OC) U7B.1(OC) U7C.1(OC) ; also sheet 1,2,3,4,5,6,8,9,10
IA0: U7A.2(1Q) U7D.10(A0) ; also sheet 3,6,9
IA1: U7A.5(2Q) U7D.9(A1) ; also sheet 3,6,9
IA2: U7A.6(3Q) U7D.8(A2) ; also sheet 3,9
IA3: U7A.9(4Q) U7D.7(A3) ; also sheet 3,9
IA4: U7A.12(5Q) U7D.6(A4) ; also sheet 3,9
IA5: U7A.15(6Q) U7D.5(A5) ; also sheet 3,9
IA6: U7A.16(7Q) U7D.4(A6) ; also sheet 3,9
IA7: U7A.19(8Q) U7D.3(A7) ; also sheet 3,9
IA8: U7B.2(1Q) U7D.25(A8) ; also sheet 3,8,9
IA9: U7B.5(2Q) U7D.24(A9) ; also sheet 3,8,9
IA10: U7B.6(3Q) U7D.21(A10) ; also sheet 3,8,9
IA11: U7B.9(4Q) U7D.23(A11) ; also sheet 3,8,9
IA12: U7B.12(5Q) U7D.2(A12) ; also sheet 3,9
IA13: U7B.15(6Q) U7D.26(A13) ; also sheet 3,9
IA14: U7B.16(7Q) U7D.27(A14) ; also sheet 3,9
IA15: U7B.19(8Q) U7D.1(A15) ; also sheet 3,9
IA16: U7C.2(1Q) ; also sheet 8,9
IA17: U7C.5(2Q) ; also sheet 8,9
IA18: U7C.6(3Q) ; also sheet 8,9
IA19: U7C.9(4Q) ; also sheet 8,9
VCC [power]: C7A.1 C7B.1 C7C.1 C7D.1 ; also sheet 1,2,3,4,5,6,8,9,10
Unconnected: U7C.12(5Q) U7C.13(5D) U7C.14(6D) U7C.15(6Q) U7C.16(7Q) U7C.17(7D) U7C.18(8D) U7C.19(8Q)

### Buses
INTL_BUS:AA[8..19],AD[0..7]
8088_ADDR:IA[0..19]

## Sheet 8 of 10: CPLD control logic
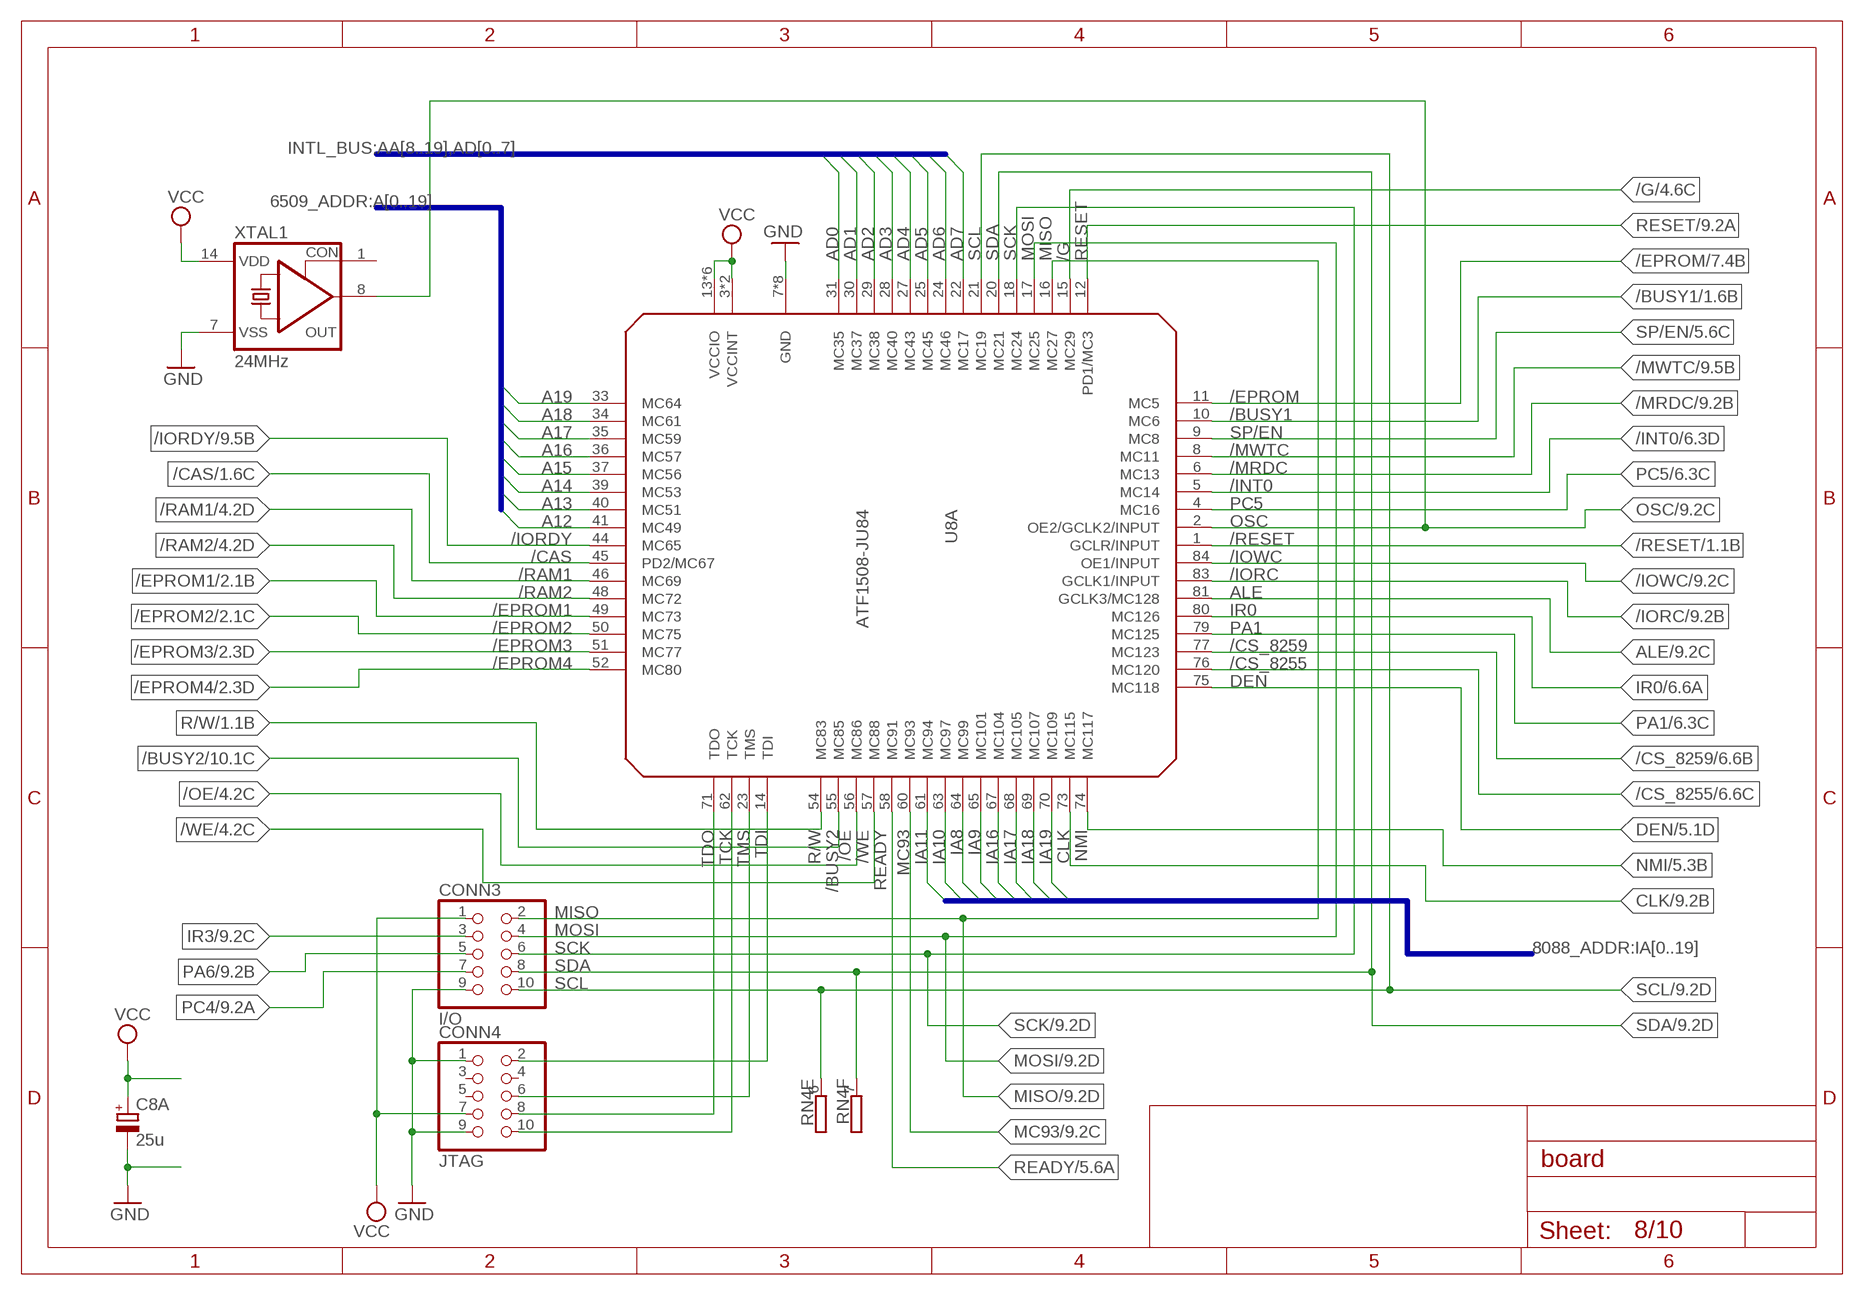
[diagram p7: schematic, sheet 8]

### Parts
C8A  25u  CPOL-EUE5-6  [E5-6]
CONN3  I/O  PINHD-2X5  [2X05]
CONN4  JTAG  PINHD-2X5  [2X05]
RN4  GE08R  [SIL9]
U8A  ATF1508-JU84  [S84]
XTAL1  24MHz  CRYSTAL_RES-SG51  [SG51]

### Nets
/BUSY1: U8A.10(MC6) ; also sheet 1,6
/BUSY2: U8A.55(MC85) ; also sheet 1,3,10
/CAS: U8A.45(PD2/MC67) ; also sheet 1
/CS_8255: U8A.76(MC120) ; also sheet 6
/CS_8259: U8A.77(MC123) ; also sheet 6
/EPROM: U8A.11(MC5) ; also sheet 7
/EPROM1: U8A.49(MC73) ; also sheet 2
/EPROM2: U8A.50(MC75) ; also sheet 2
/EPROM3: U8A.51(MC77) ; also sheet 2
/EPROM4: U8A.52(MC80) ; also sheet 2
/G: U8A.15(MC29) ; also sheet 4
/INT0: U8A.5(MC14) ; also sheet 6
/IORC: U8A.83(GCLK1/INPUT) ; also sheet 5,6,9
/IORDY: U8A.44(MC65) ; also sheet 9
/IOWC: U8A.84(OE1/INPUT) ; also sheet 5,6,9
/MRDC: U8A.6(MC13) ; also sheet 5,9
/MWTC: U8A.8(MC11) ; also sheet 5,9
/OE: U8A.56(MC86) ; also sheet 4
/RAM1: U8A.46(MC69) ; also sheet 4
/RAM2: U8A.48(MC72) ; also sheet 4
/RESET: U8A.1(GCLR/INPUT) ; also sheet 1,6
/WE: U8A.57(MC88) ; also sheet 4
A12: U8A.41(MC49) ; also sheet 1,2,3
A13: U8A.40(MC51) ; also sheet 1,3
A14: U8A.39(MC53) ; also sheet 1,3
A15: U8A.37(MC56) ; also sheet 1,3
A16: U8A.36(MC57) ; also sheet 1,4
A17: U8A.35(MC59) ; also sheet 1,4
A18: U8A.34(MC61) ; also sheet 1,4
A19: U8A.33(MC64) ; also sheet 1
AD0: U8A.31(MC35) ; also sheet 4,5,6,7,9
AD1: U8A.30(MC37) ; also sheet 4,5,6,7,9
AD2: U8A.29(MC38) ; also sheet 4,5,6,7,9
AD3: U8A.28(MC40) ; also sheet 4,5,6,7,9
AD4: U8A.27(MC43) ; also sheet 4,5,6,7,9
AD5: U8A.25(MC45) ; also sheet 4,5,6,7,9
AD6: U8A.24(MC46) ; also sheet 4,5,6,7,9
AD7: U8A.22(MC17) ; also sheet 4,5,6,7,9
ALE: U8A.81(GCLK3/MC128) ; also sheet 5,7,9
CLK: U8A.73(MC115) ; also sheet 5,9
DEN: U8A.75(MC118) ; also sheet 5
GND [power]: C8A.- CONN3.9 CONN4.1 CONN4.9 U8A.7(GND) U8A.19(GND) U8A.32(GND) U8A.42(GND) U8A.47(GND) U8A.59(GND) U8A.72(GND) U8A.82(GND) XTAL1.7(VSS) ; also sheet 1,2,3,4,5,6,7,9,10
IA8: U8A.64(MC99) ; also sheet 3,7,9
IA9: U8A.65(MC101) ; also sheet 3,7,9
IA10: U8A.63(MC97) ; also sheet 3,7,9
IA11: U8A.61(MC94) ; also sheet 3,7,9
IA16: U8A.67(MC104) ; also sheet 7,9
IA17: U8A.68(MC105) ; also sheet 7,9
IA18: U8A.69(MC107) ; also sheet 7,9
IA19: U8A.70(MC109) ; also sheet 7,9
IR0: U8A.80(MC126) ; also sheet 6
IR3: CONN3.3 ; also sheet 6,9
MC93: U8A.60(MC93) ; also sheet 9
MISO: CONN3.2 U8A.16(MC27) ; also sheet 9,10
MOSI: CONN3.4 U8A.17(MC25) ; also sheet 9,10
NMI: U8A.74(MC117) ; also sheet 5
OSC: U8A.2(OE2/GCLK2/INPUT) XTAL1.8(OUT) ; also sheet 9
PA1: U8A.79(MC125) ; also sheet 6
PA6: CONN3.5 ; also sheet 6,9
PC4: CONN3.7 ; also sheet 6,9
PC5: U8A.4(MC16) ; also sheet 6
R/W: U8A.54(MC83) ; also sheet 1,2,6
READY: U8A.58(MC91) ; also sheet 5
RESET: U8A.12(PD1/MC3) ; also sheet 5,6,9
SCK: CONN3.6 U8A.18(MC24) ; also sheet 9,10
SCL: CONN3.10 RN4.6 U8A.21(MC19) ; also sheet 9,10
SDA: CONN3.8 RN4.7 U8A.20(MC21) ; also sheet 9,10
SP/EN: U8A.9(MC8) ; also sheet 5,6
TCK: CONN4.10 U8A.62(TCK)
TDI: CONN4.2 U8A.14(TDI)
TDO: CONN4.8 U8A.71(TDO)
TMS: CONN4.6 U8A.23(TMS)
VCC [power]: C8A.+ CONN3.1 CONN4.7 U8A.3(VCCINT) U8A.13(VCCIO) U8A.26(VCCIO) U8A.38(VCCIO) U8A.43(VCCINT) U8A.53(VCCIO) U8A.66(VCCIO) U8A.78(VCCIO) XTAL1.14(VDD) ; also sheet 1,2,3,4,5,6,7,9,10
Unconnected: CONN4.3 CONN4.4 CONN4.5 XTAL1.1(CON)

### Buses
6509_ADDR:A[0..19]
8088_ADDR:IA[0..19]
INTL_BUS:AA[8..19],AD[0..7]

## Sheet 9 of 10: Expansion connector
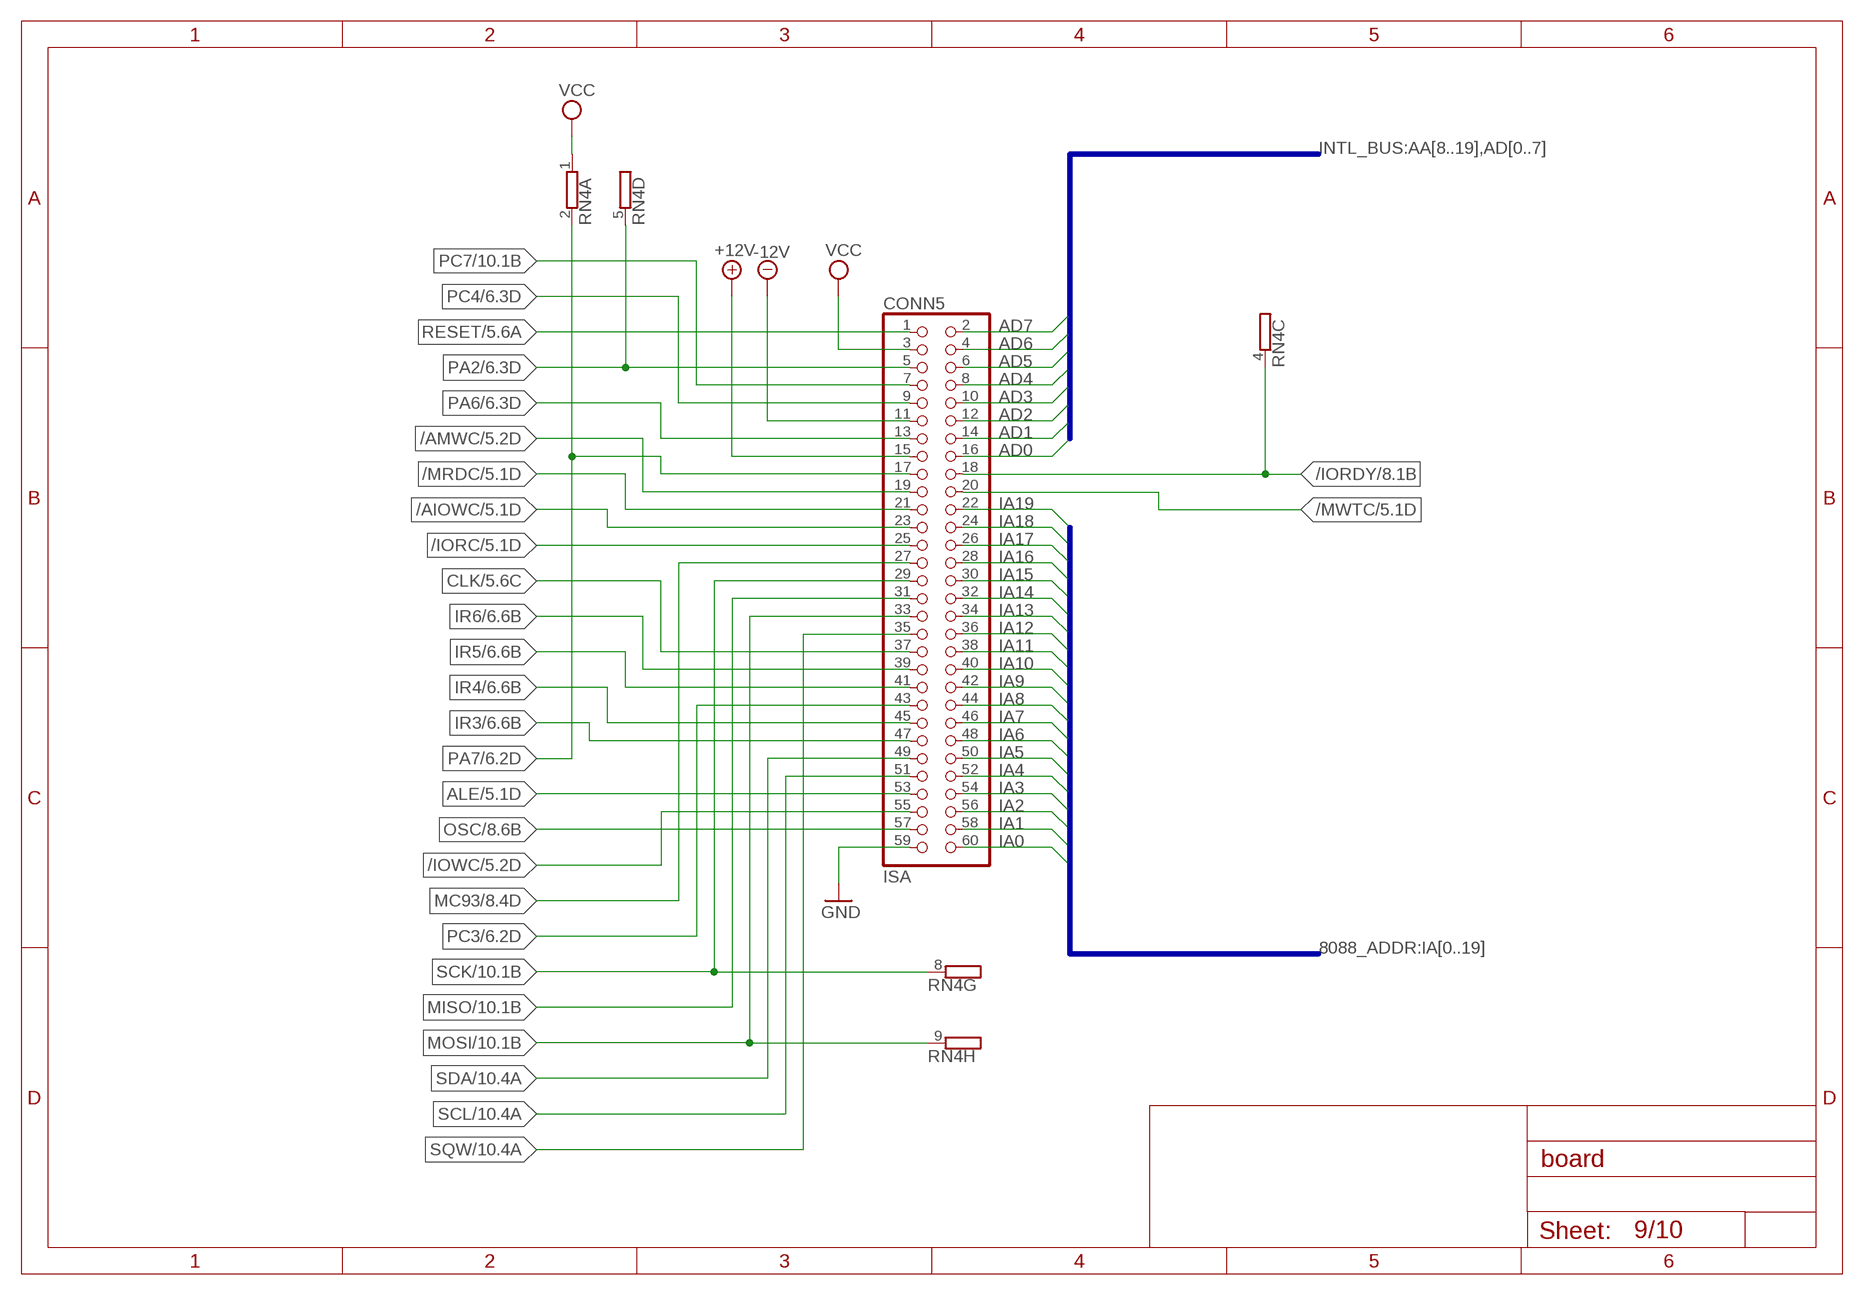
[diagram p8: schematic, sheet 9]

### Parts
CONN5  ISA  PINHD-2X30  [2X30]

### Nets
+12V [power]: CONN5.15 ; also sheet 1
-12V [power]: CONN5.11 ; also sheet 1
/AIOWC: CONN5.23 ; also sheet 5
/AMWC: CONN5.19 ; also sheet 5
/IORC: CONN5.25 ; also sheet 5,6,8
/IORDY: CONN5.18 RN4.4 ; also sheet 8
/IOWC: CONN5.55 ; also sheet 5,6,8
/MRDC: CONN5.21 ; also sheet 5,8
/MWTC: CONN5.20 ; also sheet 5,8
AD0: CONN5.16 ; also sheet 4,5,6,7,8
AD1: CONN5.14 ; also sheet 4,5,6,7,8
AD2: CONN5.12 ; also sheet 4,5,6,7,8
AD3: CONN5.10 ; also sheet 4,5,6,7,8
AD4: CONN5.8 ; also sheet 4,5,6,7,8
AD5: CONN5.6 ; also sheet 4,5,6,7,8
AD6: CONN5.4 ; also sheet 4,5,6,7,8
AD7: CONN5.2 ; also sheet 4,5,6,7,8
ALE: CONN5.53 ; also sheet 5,7,8
CLK: CONN5.37 ; also sheet 5,8
GND [power]: CONN5.59 ; also sheet 1,2,3,4,5,6,7,8,10
IA0: CONN5.60 ; also sheet 3,6,7
IA1: CONN5.58 ; also sheet 3,6,7
IA2: CONN5.56 ; also sheet 3,7
IA3: CONN5.54 ; also sheet 3,7
IA4: CONN5.52 ; also sheet 3,7
IA5: CONN5.50 ; also sheet 3,7
IA6: CONN5.48 ; also sheet 3,7
IA7: CONN5.46 ; also sheet 3,7
IA8: CONN5.44 ; also sheet 3,7,8
IA9: CONN5.42 ; also sheet 3,7,8
IA10: CONN5.40 ; also sheet 3,7,8
IA11: CONN5.38 ; also sheet 3,7,8
IA12: CONN5.36 ; also sheet 3,7
IA13: CONN5.34 ; also sheet 3,7
IA14: CONN5.32 ; also sheet 3,7
IA15: CONN5.30 ; also sheet 3,7
IA16: CONN5.28 ; also sheet 7,8
IA17: CONN5.26 ; also sheet 7,8
IA18: CONN5.24 ; also sheet 7,8
IA19: CONN5.22 ; also sheet 7,8
IR3: CONN5.47 ; also sheet 6,8
IR4: CONN5.45 ; also sheet 6
IR5: CONN5.41 ; also sheet 6
IR6: CONN5.39 ; also sheet 6
MC93: CONN5.27 ; also sheet 8
MISO: CONN5.31 ; also sheet 8,10
MOSI: CONN5.33 RN4.9 ; also sheet 8,10
OSC: CONN5.57 ; also sheet 8
PA2: CONN5.5 RN4.5 ; also sheet 6
PA6: CONN5.13 ; also sheet 6,8
PA7: CONN5.17 RN4.2 ; also sheet 6
PC3: CONN5.43 ; also sheet 6
PC4: CONN5.9 ; also sheet 6,8
PC7: CONN5.7 ; also sheet 6,10
RESET: CONN5.1 ; also sheet 5,6,8
SCK: CONN5.29 RN4.8 ; also sheet 8,10
SCL: CONN5.51 ; also sheet 8,10
SDA: CONN5.49 ; also sheet 8,10
SQW: CONN5.35 ; also sheet 10
VCC [power]: CONN5.3 RN4.1 ; also sheet 1,2,3,4,5,6,7,8,10

### Buses
INTL_BUS:AA[8..19],AD[0..7]
8088_ADDR:IA[0..19]

## Sheet 10 of 10: I/O peripherals
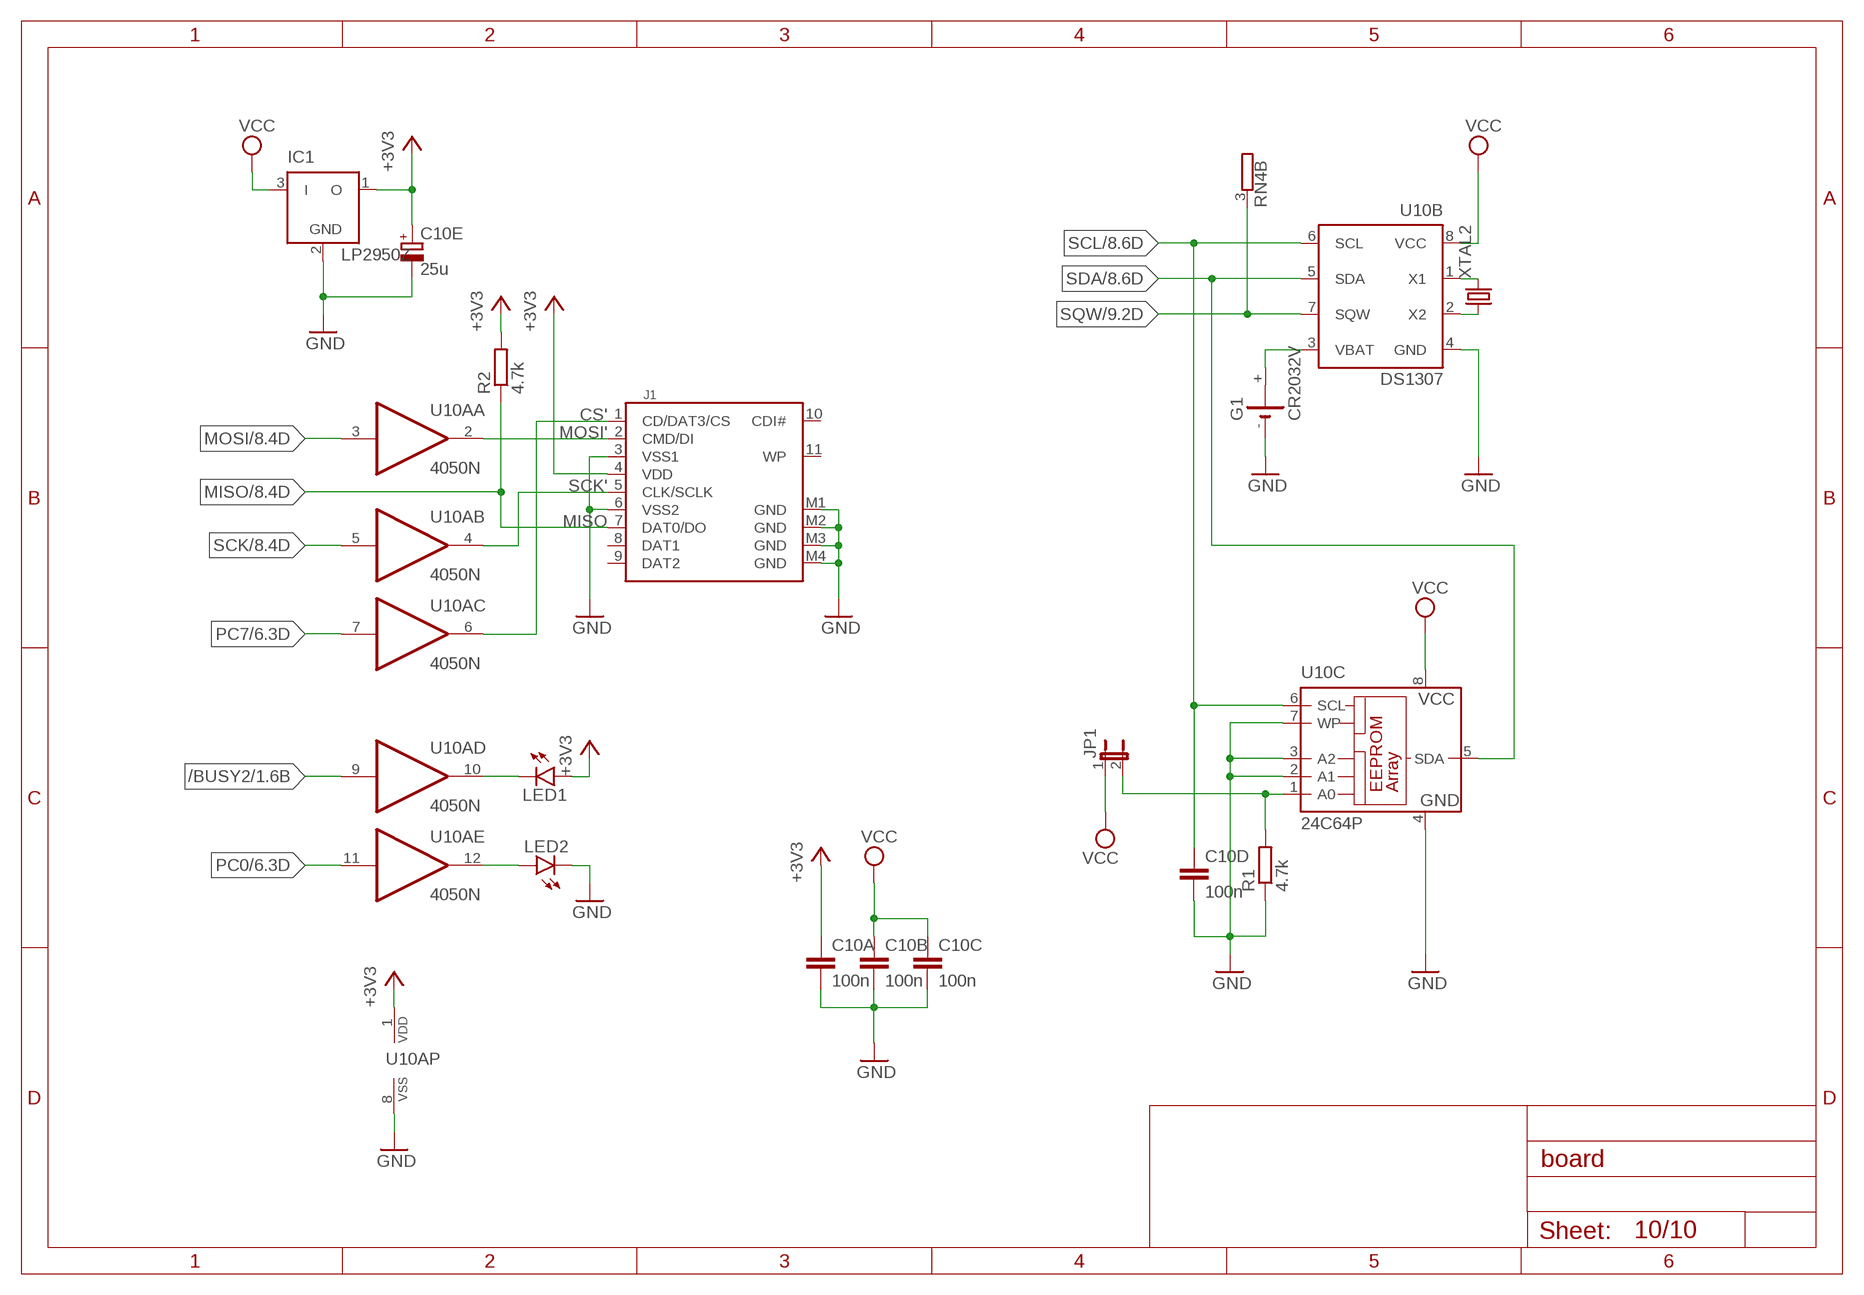
[diagram p9: schematic, sheet 10]

### Parts
C10A  100n  C-EU050-025X075  [C050-025X075]
C10B  100n  C-EU050-025X075  [C050-025X075]
C10C  100n  C-EU050-025X075  [C050-025X075]
C10D  100n  C-EU050-025X075  [C050-025X075]
C10E  25u  CPOL-EUE5-6  [E5-6]
G1  CR2032V  [CR2032V]
IC1  LP2950Z  [TO92]
J1  SDCARD  [SDCMF-10915W010]
JP1  JP1E  [JP1]
LED1  LEDSQR5.7X3.2  [U57X32]
LED2  LEDSQR5.7X3.2  [U57X32]
R1  4.7k  R-EU_0207/10  [0207/10]
R2  4.7k  R-EU_0207/10  [0207/10]
U10A  4050N  [DIL16]
U10B  DS1307  [DIL08]
U10C  24C64P  [DIL8]
XTAL2  CRYSTALTC38H  [TC38H]

### Nets
+3V3 [power]: C10A.1 C10E.+ IC1.1(O) J1.4(VDD) LED1.A R2.2 U10A.1(P:VDD)
/BUSY2: U10A.9(D:I) ; also sheet 1,3,8
BATT: G1.+ U10B.3(VBAT)
CS': J1.1(CD/DAT3/CS) U10A.6(C:O)
GND [power]: C10A.2 C10B.2 C10C.2 C10D.2 C10E.- G1.- IC1.2(GND) J1.3(VSS1) J1.6(VSS2) J1.M1(GND) J1.M2(GND) J1.M3(GND) J1.M4(GND) LED2.K(C) R1.1 U10A.8(P:VSS) U10B.4(GND) U10C.2(A1) U10C.3(A2) U10C.4(GND) U10C.7(WP) ; also sheet 1,2,3,4,5,6,7,8,9
LED1: LED1.K(C) U10A.10(D:O)
LED2: LED2.A U10A.12(E:O)
MISO: J1.7(DAT0/DO) R2.1 ; also sheet 8,9
MOSI: U10A.3(A:I) ; also sheet 8,9
MOSI': J1.2(CMD/DI) U10A.2(A:O)
N$1: JP1.2 R1.2 U10C.1(A0)
PC0: U10A.11(E:I) ; also sheet 6
PC7: U10A.7(C:I) ; also sheet 6,9
SCK: U10A.5(B:I) ; also sheet 8,9
SCK': J1.5(CLK/SCLK) U10A.4(B:O)
SCL: C10D.1 U10B.6(SCL) U10C.6(SCL) ; also sheet 8,9
SDA: U10B.5(SDA) U10C.5(SDA) ; also sheet 8,9
SQW: RN4.3 U10B.7(SQW) ; also sheet 9
VCC [power]: C10B.1 C10C.1 IC1.3(I) JP1.1 U10B.8(VCC) U10C.8(VCC) ; also sheet 1,2,3,4,5,6,7,8,9
XTAL1 [power]: U10B.1(X1) XTAL2.2
XTAL2 [power]: U10B.2(X2) XTAL2.1
Unconnected: G1.+@1(+) J1.8(DAT1) J1.9(DAT2) J1.10(CDI#) J1.11(WP) U10A.14(F:I) U10A.15(F:O)

## Power pins joined to a net without a drawn wire
GND: U2E.12(GND) U3A.8(GND) U3B.8(GND) U3C.8(GND) U3D.8(GND) U4C.10(GND) U5A.1(GND) U5A.20(GND) U5B.1(GND) U5B.20(GND) U5C.10(GND) U6A.1(GND) U6B.7(GND) U6C.14(GND) U7A.10(GND) U7B.10(GND) U7C.10(GND) U7D.14(GND)
VCC: U2E.24(VCC) U3A.16(VCC) U3B.16(VCC) U3C.16(VCC) U3D.16(VCC) U4C.20(VCC) U5A.40(VCC) U5B.40(VCC) U5C.20(VCC) U6A.20(VCC) U6B.26(VCC) U6C.28(VCC) U7A.20(VCC) U7B.20(VCC) U7C.20(VCC) U7D.28(VCC)

## Library data of the parts
C2A C2B C2C C2D C2E C3A C3B C3C C3D C4A C4B C4C C5A C5B C5C C6A C6B C6C C7A C7B C7C C7D C10A C10B C10C C10D = rcl:C-EU: CAPACITOR, European symbol
C8A C10E = rcl:CPOL-EU: POLARIZED CAPACITOR, European symbol
CONN1 CONN5 = pinhead:PINHD-2X30: PIN HEADER
CONN2 = pinhead:PINHD-2X20: PIN HEADER
CONN3 CONN4 = pinhead:PINHD-2X5: PIN HEADER
G1 = battery:CR2032V: LI BATTERY Varta
IC1 = linear:LP2950: 100 mA, Low Power Low Dropout Voltage Regulator Source: http://www.onsemi.com/pub/Collateral/LP2950-D.PDF
J1 = sd-mmc:SDCARD: SD card connector KINGFONT SDCMF-10915W010
JP1 = jumper:JP1E: JUMPER
LED1 LED2 = led:LED: LED OSRAM: - CHIPLED LG R971, LG N971, LY N971, LG Q971, LY Q971, LO R971, LY R971 LH N974, LH R974 LS Q976, LO Q976, LY Q976 LO Q996 - Hyper CHIPLED LW Q18S LB Q993, LB Q99A, LB R99A - SideLED LS A670, LO A670, LY A670, LG A670, LP A670 LB A673, LV A673, LT A673, LW A673 LH A674 LY A675 LS A676, LA A676, LO A676, LY A676, LW A676 LS A679, LY A679, LG A679 - Hyper Micro SIDELED® LS Y876, LA Y876, LO Y876, LY Y876 LT Y87S - SmartLED LW L88C, LW L88S LB L89C, LB L89S, LG L890 LS L89K, LO L89K, LY L89K LS L896, LA L896, LO L896, LY L896 - TOPLED LS T670, LO T670, LY T670, LG T670, LP T670 LSG T670, LSP T670, LSY T670, LOP T670, LYG T670 LG T671, LOG T671, LSG T671 LB T673, LV T673, LT T673, LW T673 LH T674 LS T676, LA T676, LO T676, LY T676, LB T676, LH T676, LSB T676, LW T676 LB T67C, LV T67C, LT T67C, LS T67K, LO T67K, LY T67K, LW E67C LS E67B, LA E67B, LO E67B, LY E67B, LB E67C, LV E67C, LT E67C LW T67C LS T679, LY T679, LG T679 LS T770, LO T770, LY T770, LG T770, LP T770 LB T773, LV T773, LT T773, LW T773 LH T774 LS E675, LA E675, LY E675, LS T675 LS T776, LA T776, LO T776, LY T776, LB T776 LHGB T686 LT T68C, LB T68C - Hyper Mini TOPLED® LB M676 - Mini TOPLED Santana® LG M470 LS M47K, LO M47K, LY M47K Source: http://www.osram.convergy.de LUXEON: - LUMILED® LXK2-PW12-R00, LXK2-PW12-S00, LXK2-PW14-U00, LXK2-PW14-V00 LXK2-PM12-R00, LXK2-PM12-S00, LXK2-PM14-U00 LXK2-PE12-Q00, LXK2-PE12-R00, LXK2-PE12-S00, LXK2-PE14-T00, LXK2-PE14-U00 LXK2-PB12-K00, LXK2-PB12-L00, LXK2-PB12-M00, LXK2-PB14-N00, LXK2-PB14-P00, LXK2-PB14-Q00 LXK2-PR12-L00, LXK2-PR12-M00, LXK2-PR14-Q00, LXK2-PR14-R00 LXK2-PD12-Q00, LXK2-PD12-R00, LXK2-PD12-S00 LXK2-PH12-R00, LXK2-PH12-S00 LXK2-PL12-P00, LXK2-PL12-Q00, LXK2-PL12-R00 Source: www.luxeon.com KINGBRIGHT: KA-3528ASYC Source: www.kingbright.com
R1 R2 = resistor:R-EU_: RESISTOR, European symbol
RN1-RN4 = resistor-sil:GE08R: SIL RESISTOR; OC_FARNELL: unknown; OC_NEWARK: unknown
U2A U2B U2C U2D = memory-hitachi:6264A: MEMORY; OC_FARNELL: 283605; OC_NEWARK: unknown
U2E = 0RB_Memory:6116: 2K*8 SRAM
U3A U3B U3C U3D = 74xx-eu:74*257: Quadruple 2-to 1 line data SELECTOR/MULTIPLEXER
U4A U4B = hitachi_sram_hm628512a-series_rev1:HM628512A_DIL32: 4M SRAM 512kword x 8bit
U4C = 74xx-us:74*245: Octal BUS TRANSCEIVER, 3-state
U5A = 0Ruud:8088MAX: MICROCOMPUTER/PERIPHERAL DEVICE
U5B = 0Ruud:8087: MICROCOMPUTER/PERIPHERAL DEVICE
U5C = micro-siemens:8288-A: MICROPROCESSOR/PERIPHERAL DEVICE
U6A = 0RB_65xx:6526: I/O device: two 8-bits ports, handshake lines, timers. Used in C64 and C128.
U6B = micro-intel:8255A: MICROCOMPUTER/PERIPHERAL DEVICE; OC_FARNELL: unknown; OC_NEWARK: unknown
U6C = micro-intel:8259A: MICROCOMPUTER/PERIPHERAL DEVICE; OC_FARNELL: unknown; OC_NEWARK: unknown
U7A U7B U7C = 74xx-eu:74*373: Octal D type transparent LATCH, edge triggered
U7D = memory:27512: MEMORY
U8A = michau:ATF1508-JU84
U10A = 40xx:4050: Hex non-inverting BUFFER
U10B = ds1307_pcf8583:DS1307: I2C-Bus CLOCK/CALENDAR
U10C = microchip:24*: Serial EEPROM I2C; MF: RAMTRON INTERNATIONAL CORP; MPN: FM24C64-P; OC_FARNELL: 1362657; OC_NEWARK: 97H6452
XTAL1 = crystal:CRYSTAL_RES-: CRYSTAL RESONATOR; OC_FARNELL: unknown; OC_NEWARK: unknown
XTAL2 = crystal:CRYSTAL: CRYSTAL; OC_FARNELL: unknown; OC_NEWARK: unknown

## Net classes
0 default: width 0.127 mm, drill 0.127 mm, clearance 0.127 mm
1 power: width 0.381 mm, drill 0.254 mm, clearance 0.254 mm to class 0, clearance 0.254 mm